# EAGLE schematic GC_LINE_2026_INCHEON (EAGLE 9.7.0)
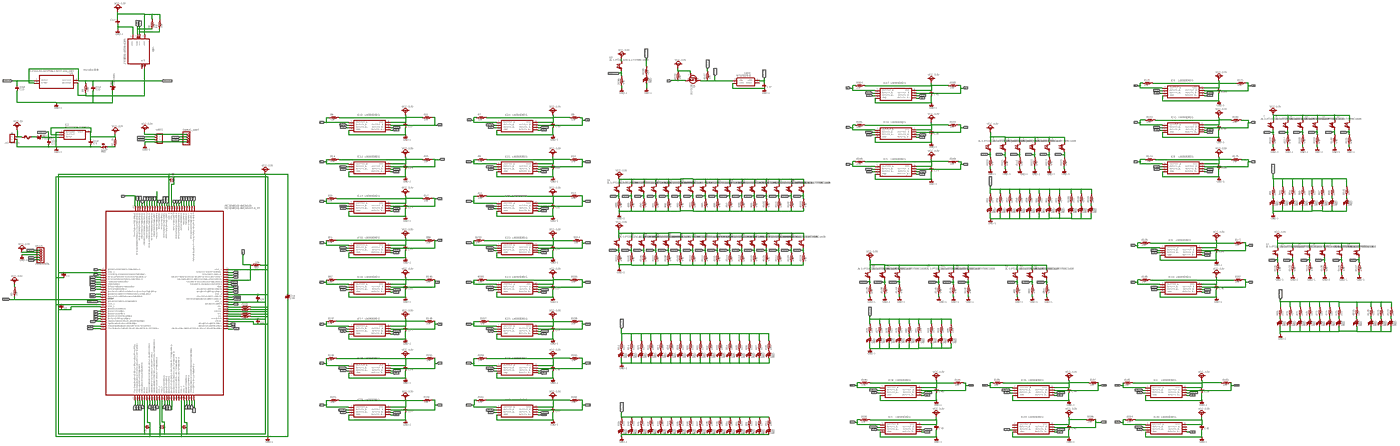
[diagram p0: schematic, sheet 1, overview]
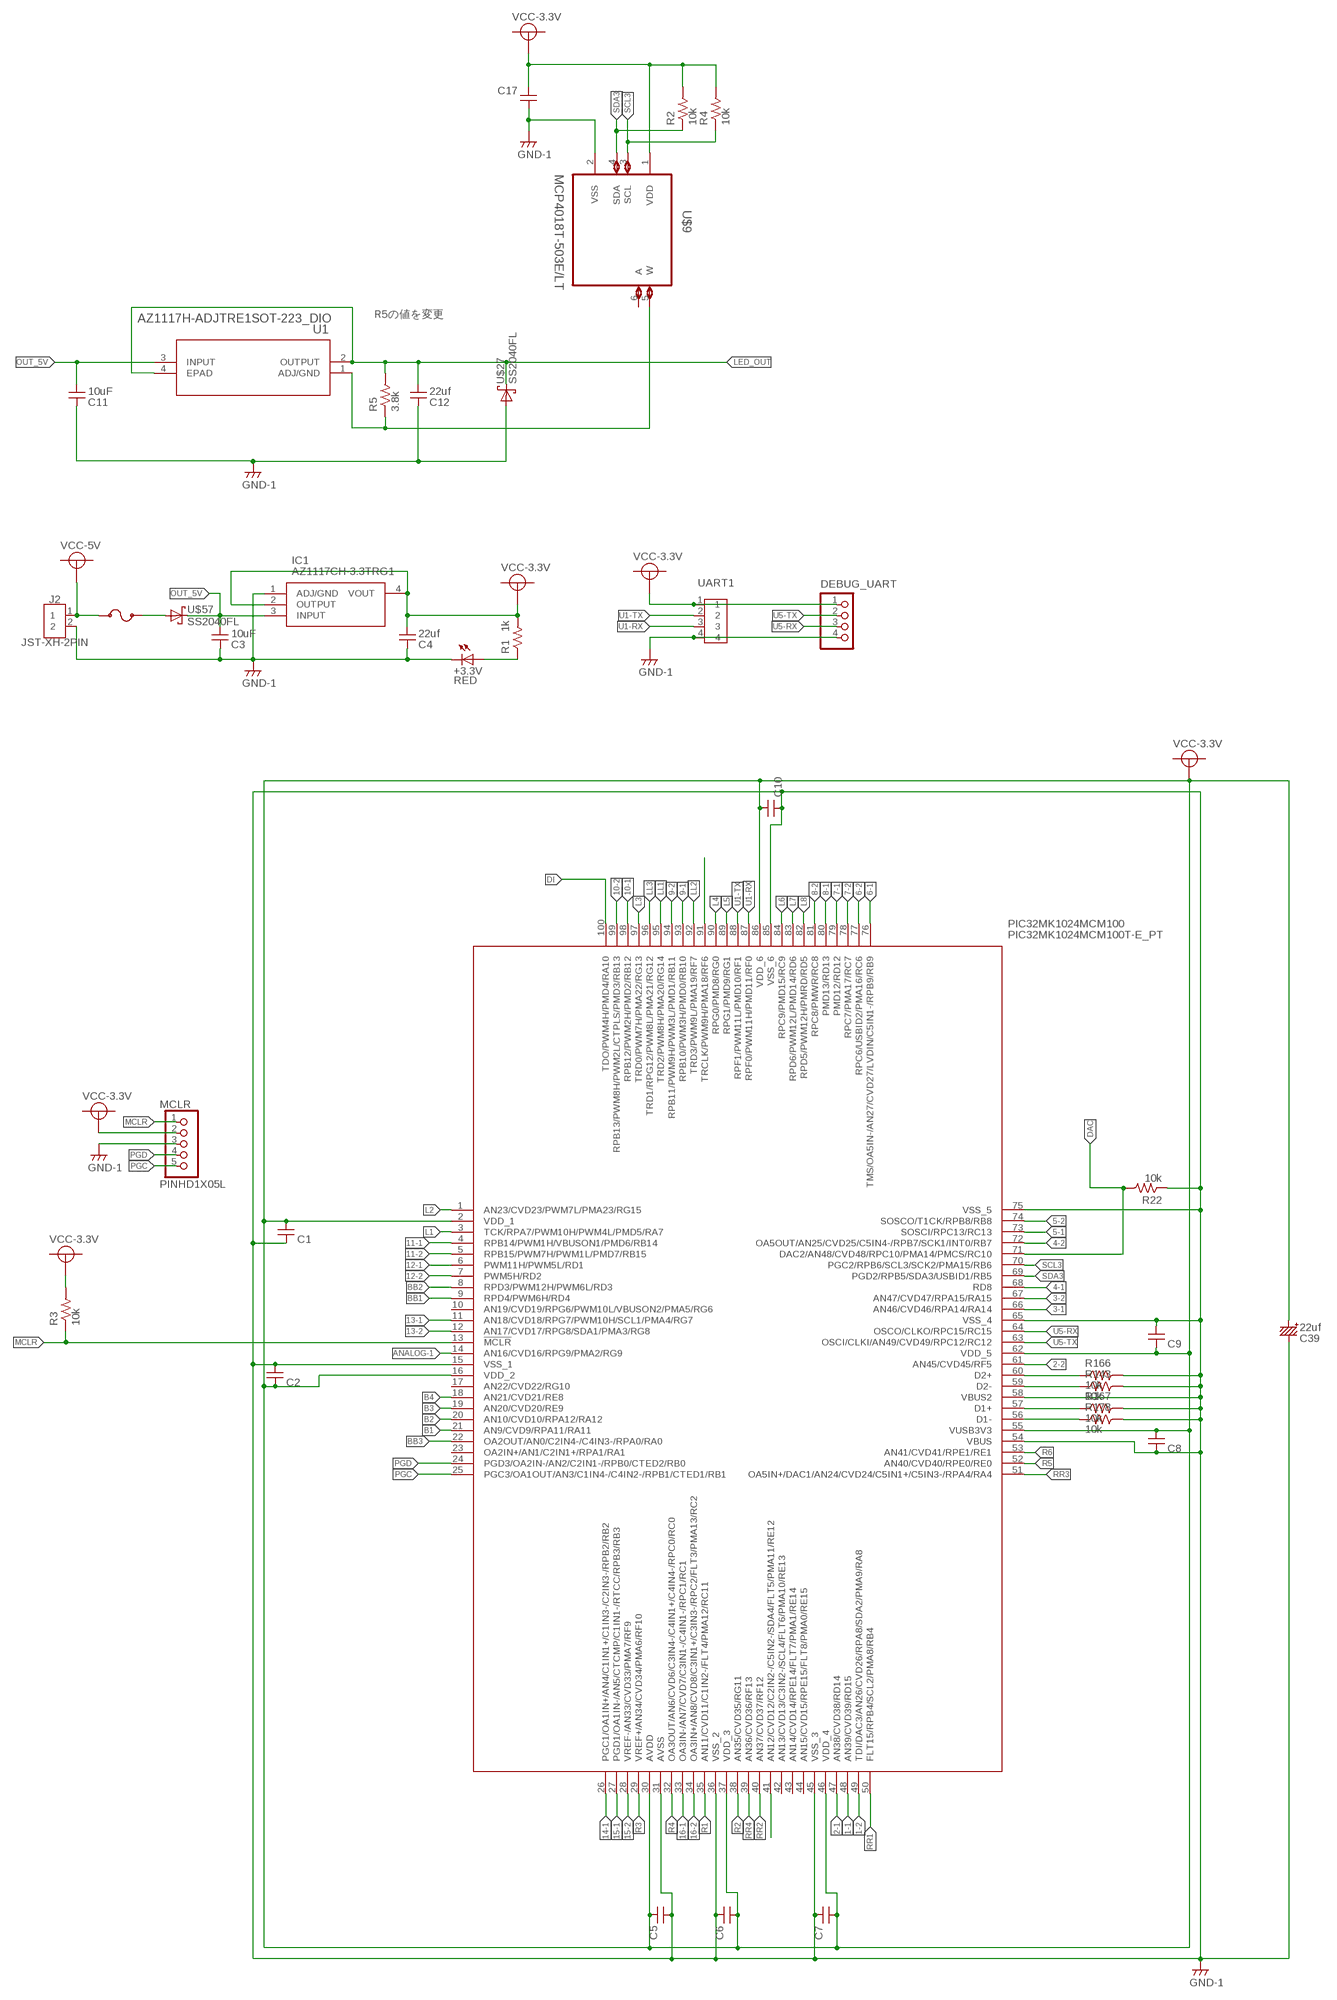
[diagram p1: schematic, sheet 1, part 1 of 4]
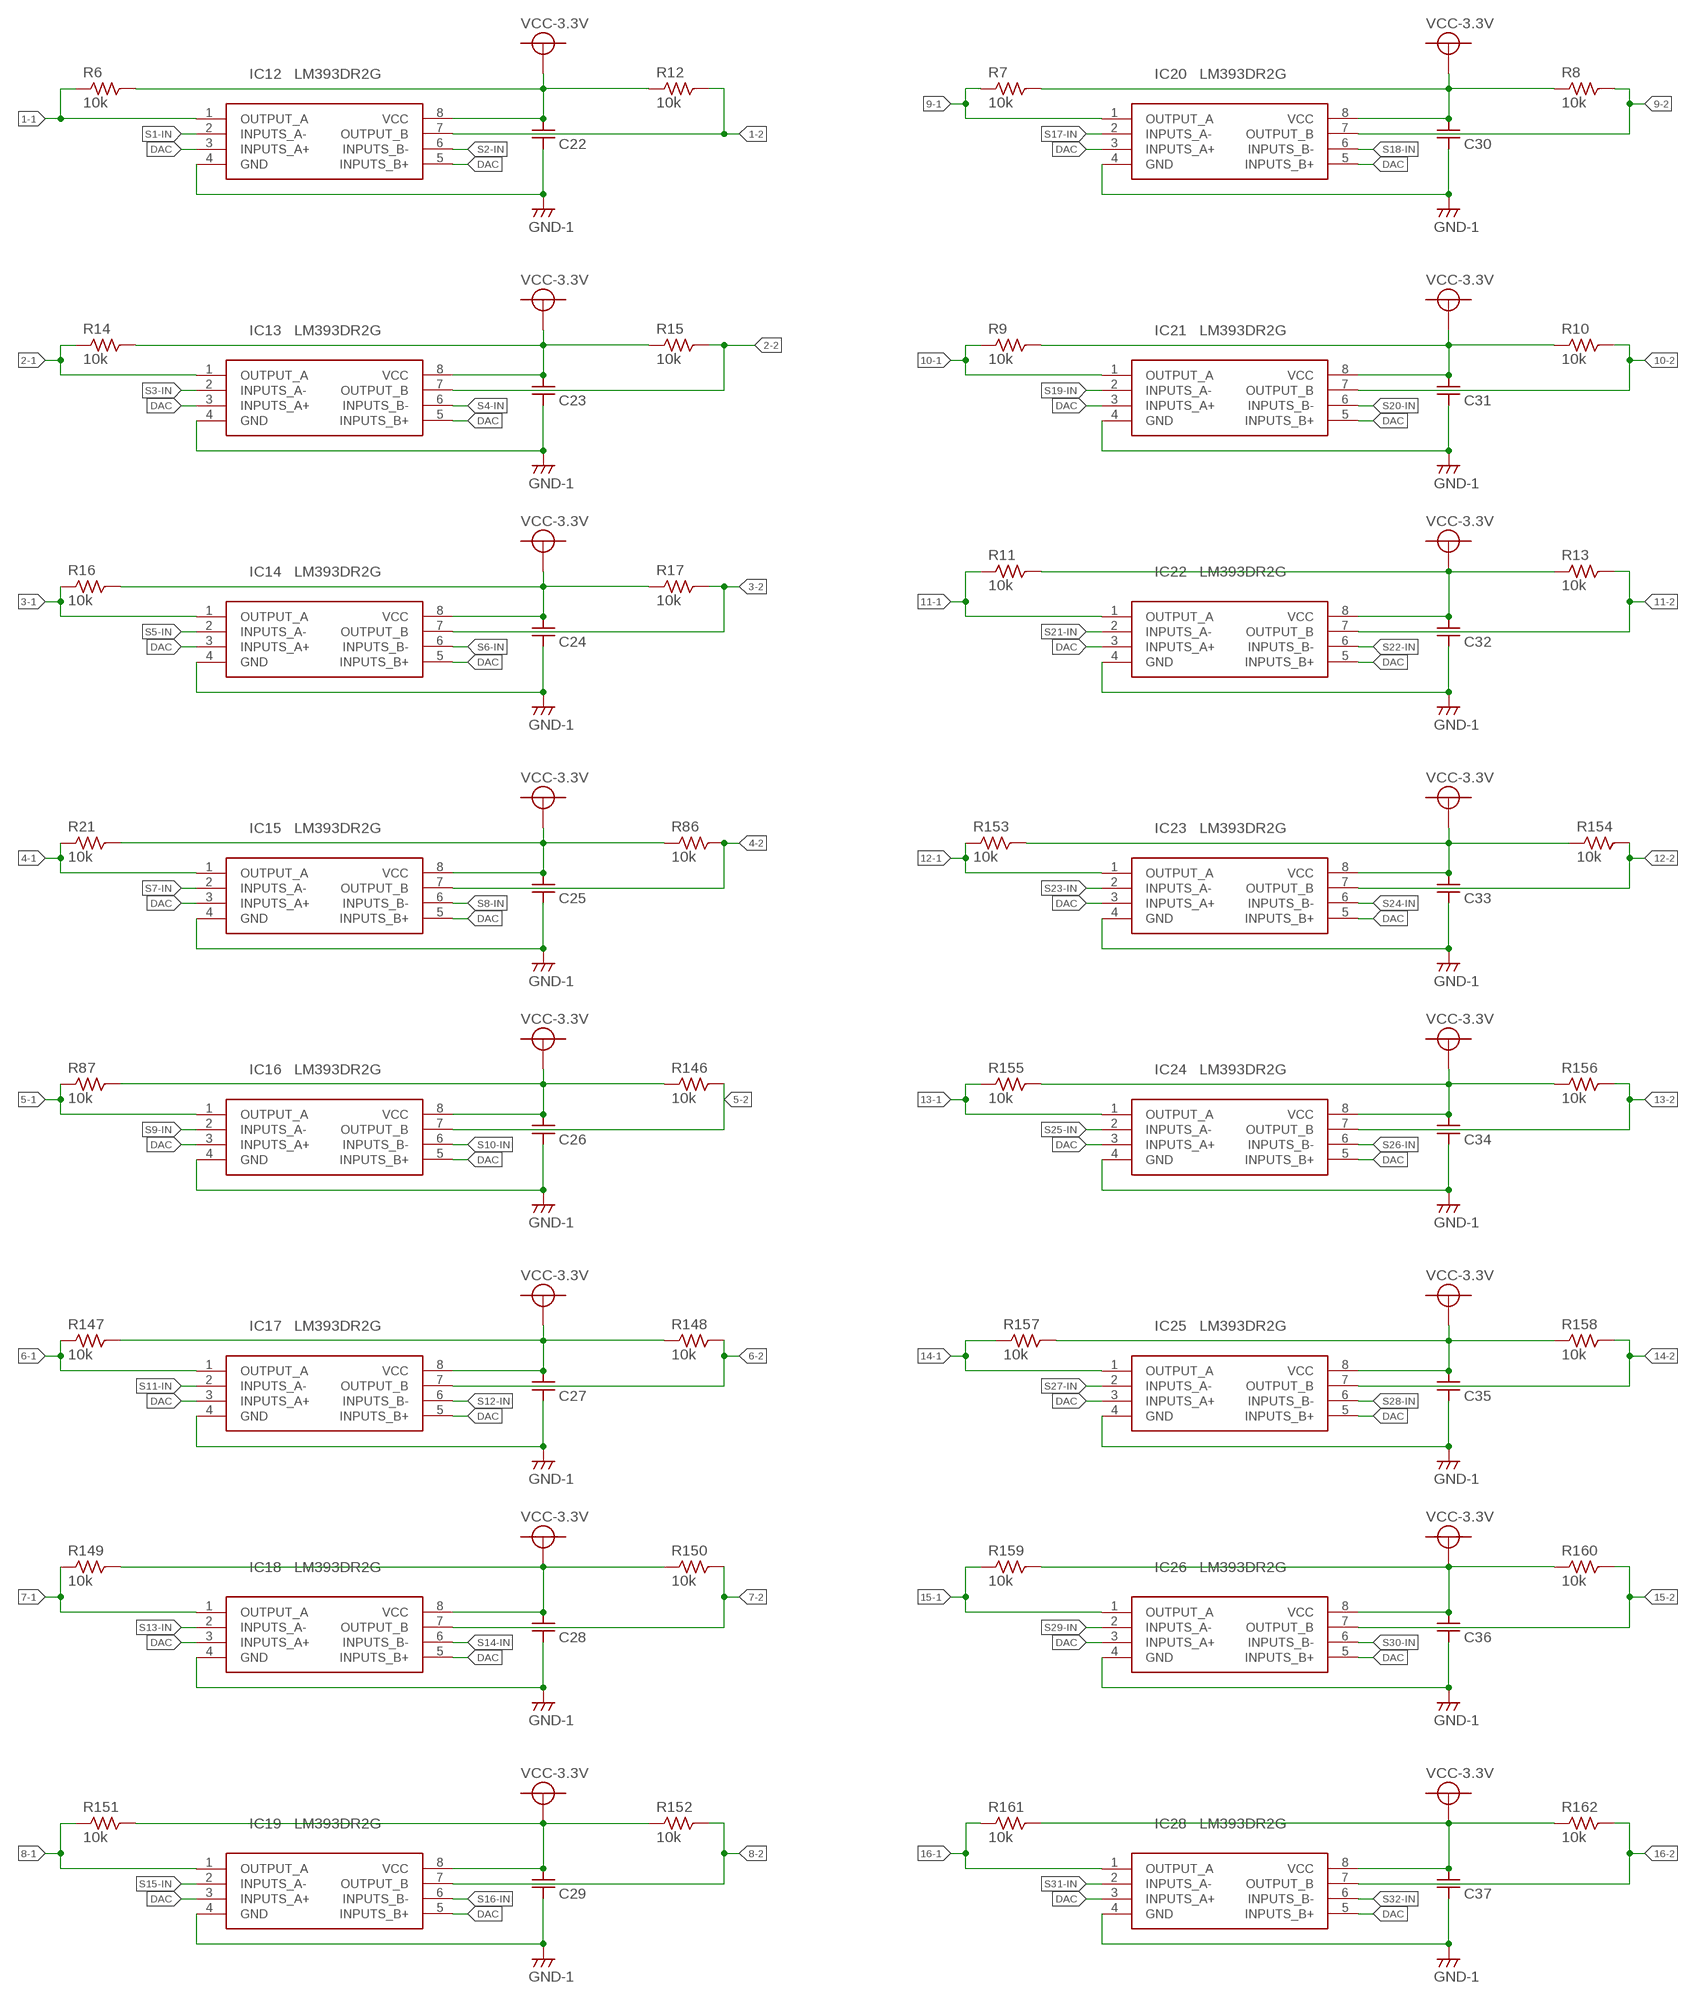
[diagram p2: schematic, sheet 1, part 2 of 4]
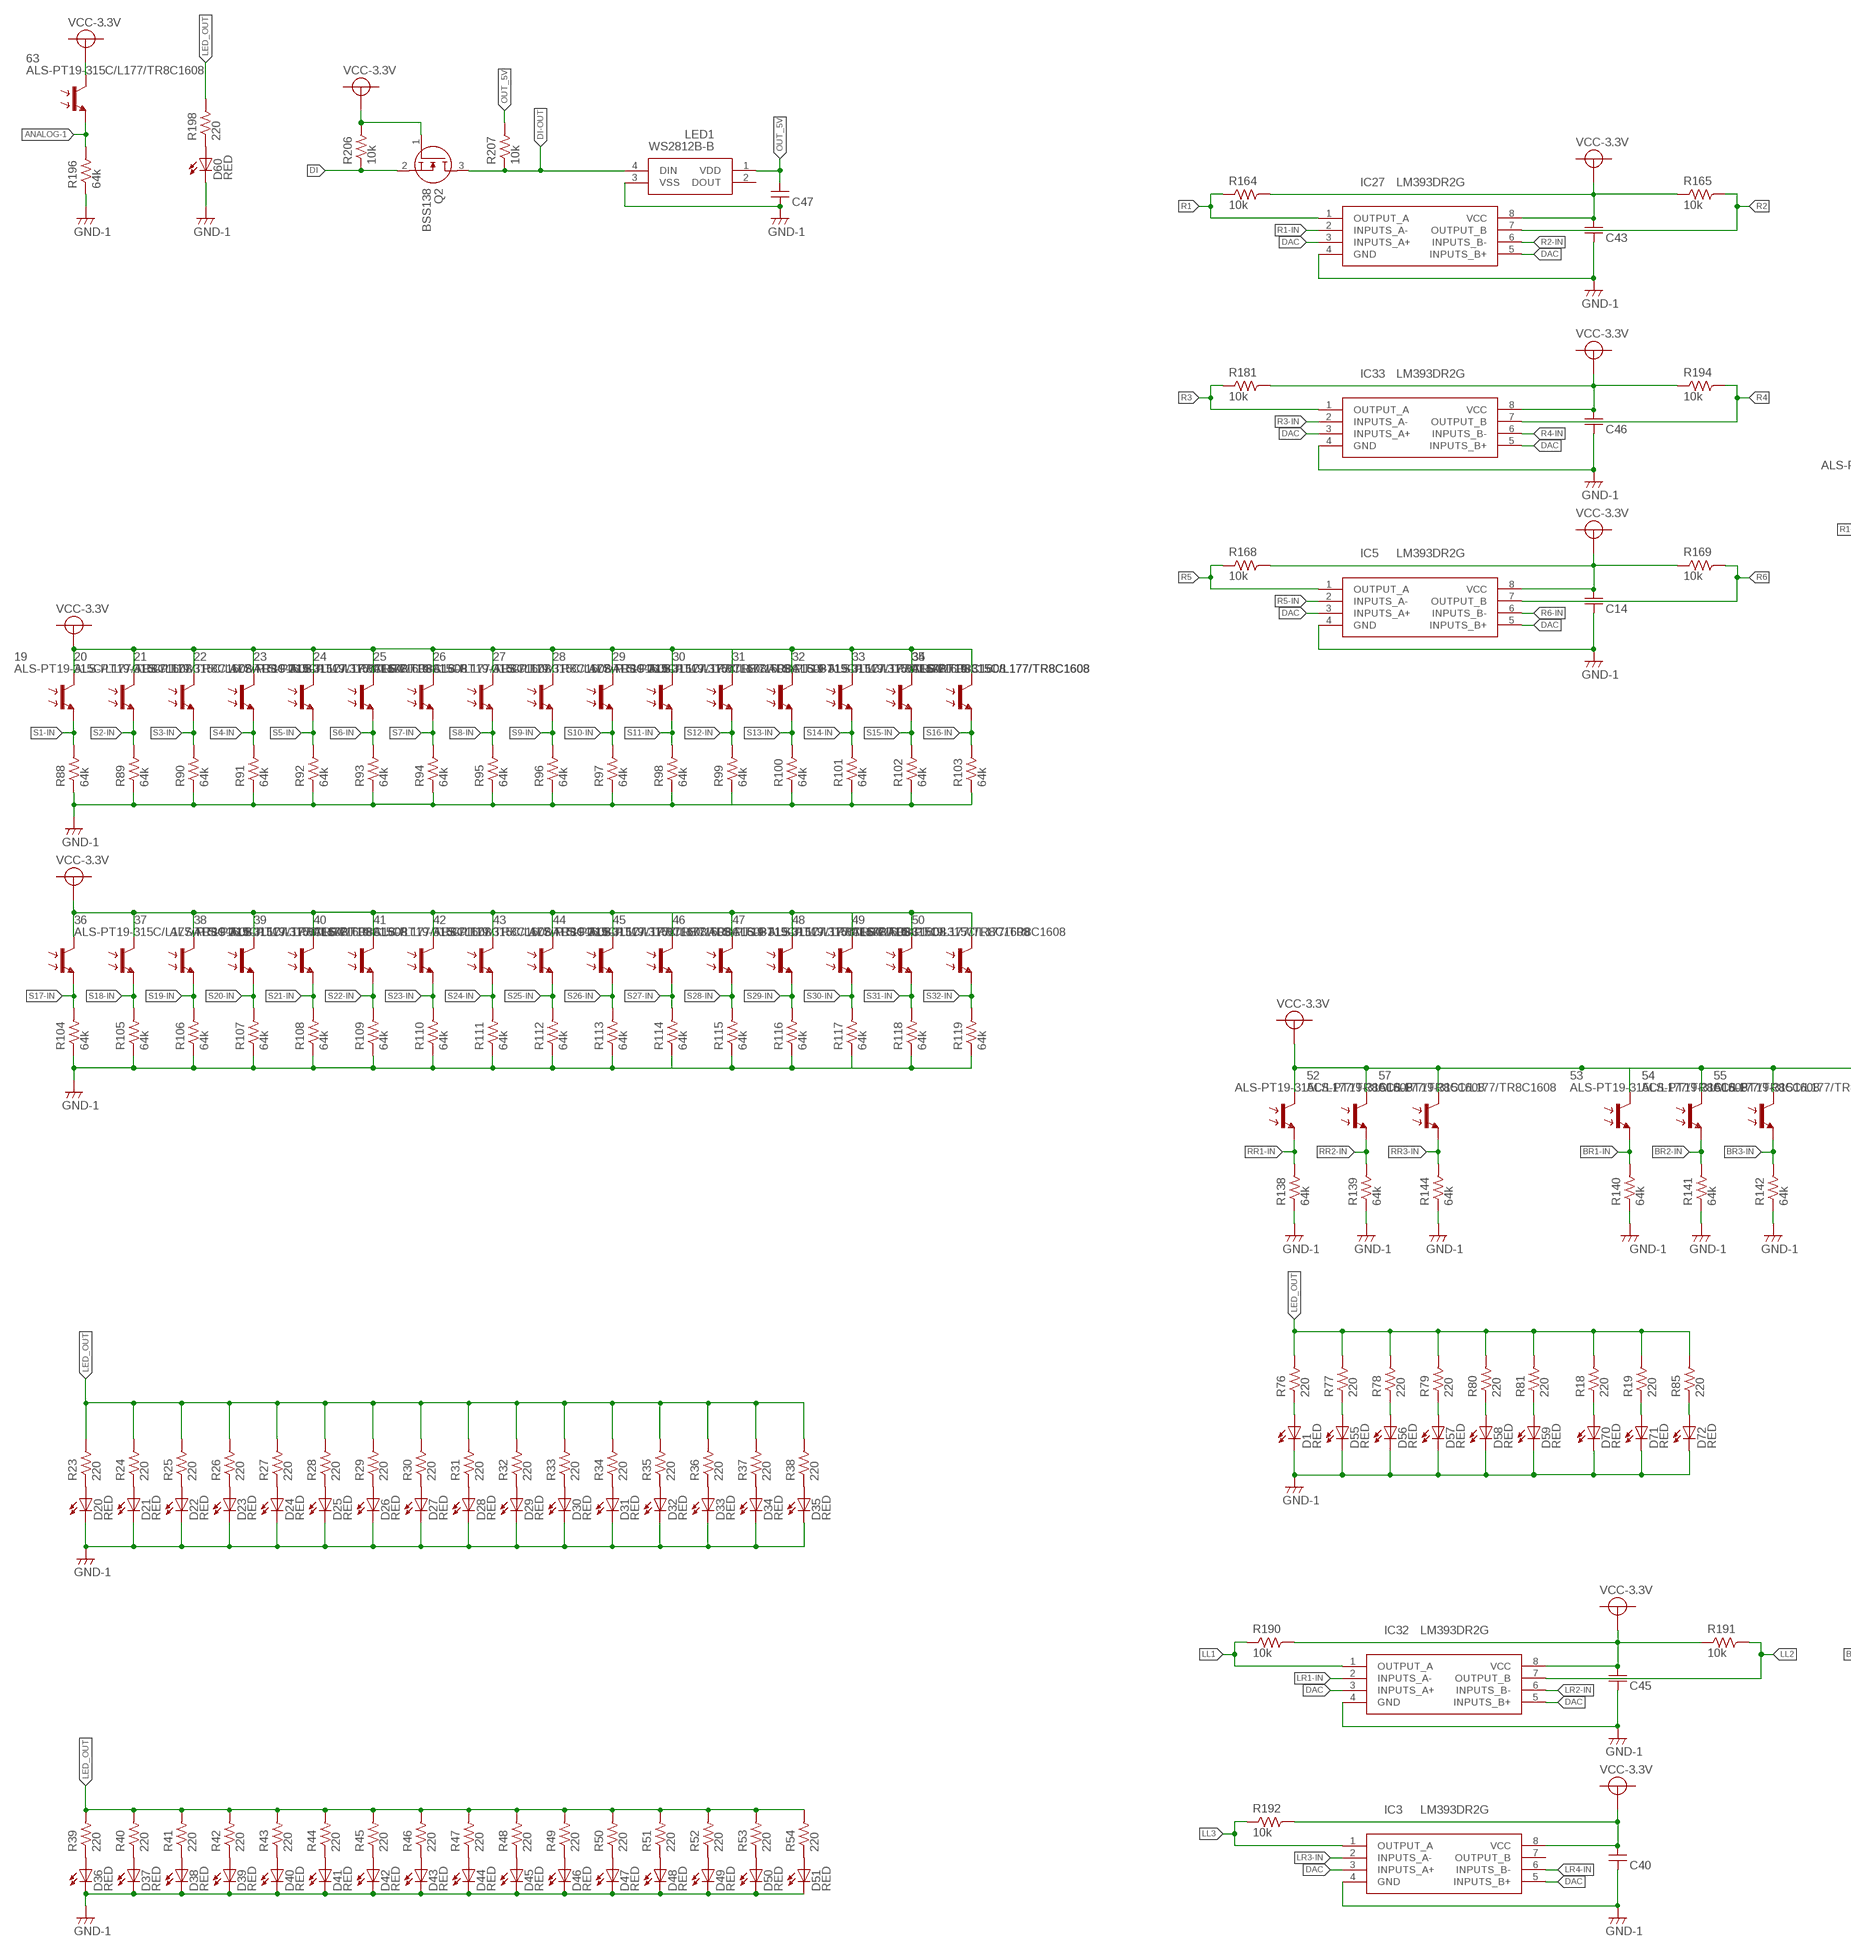
[diagram p3: schematic, sheet 1, part 3 of 4]
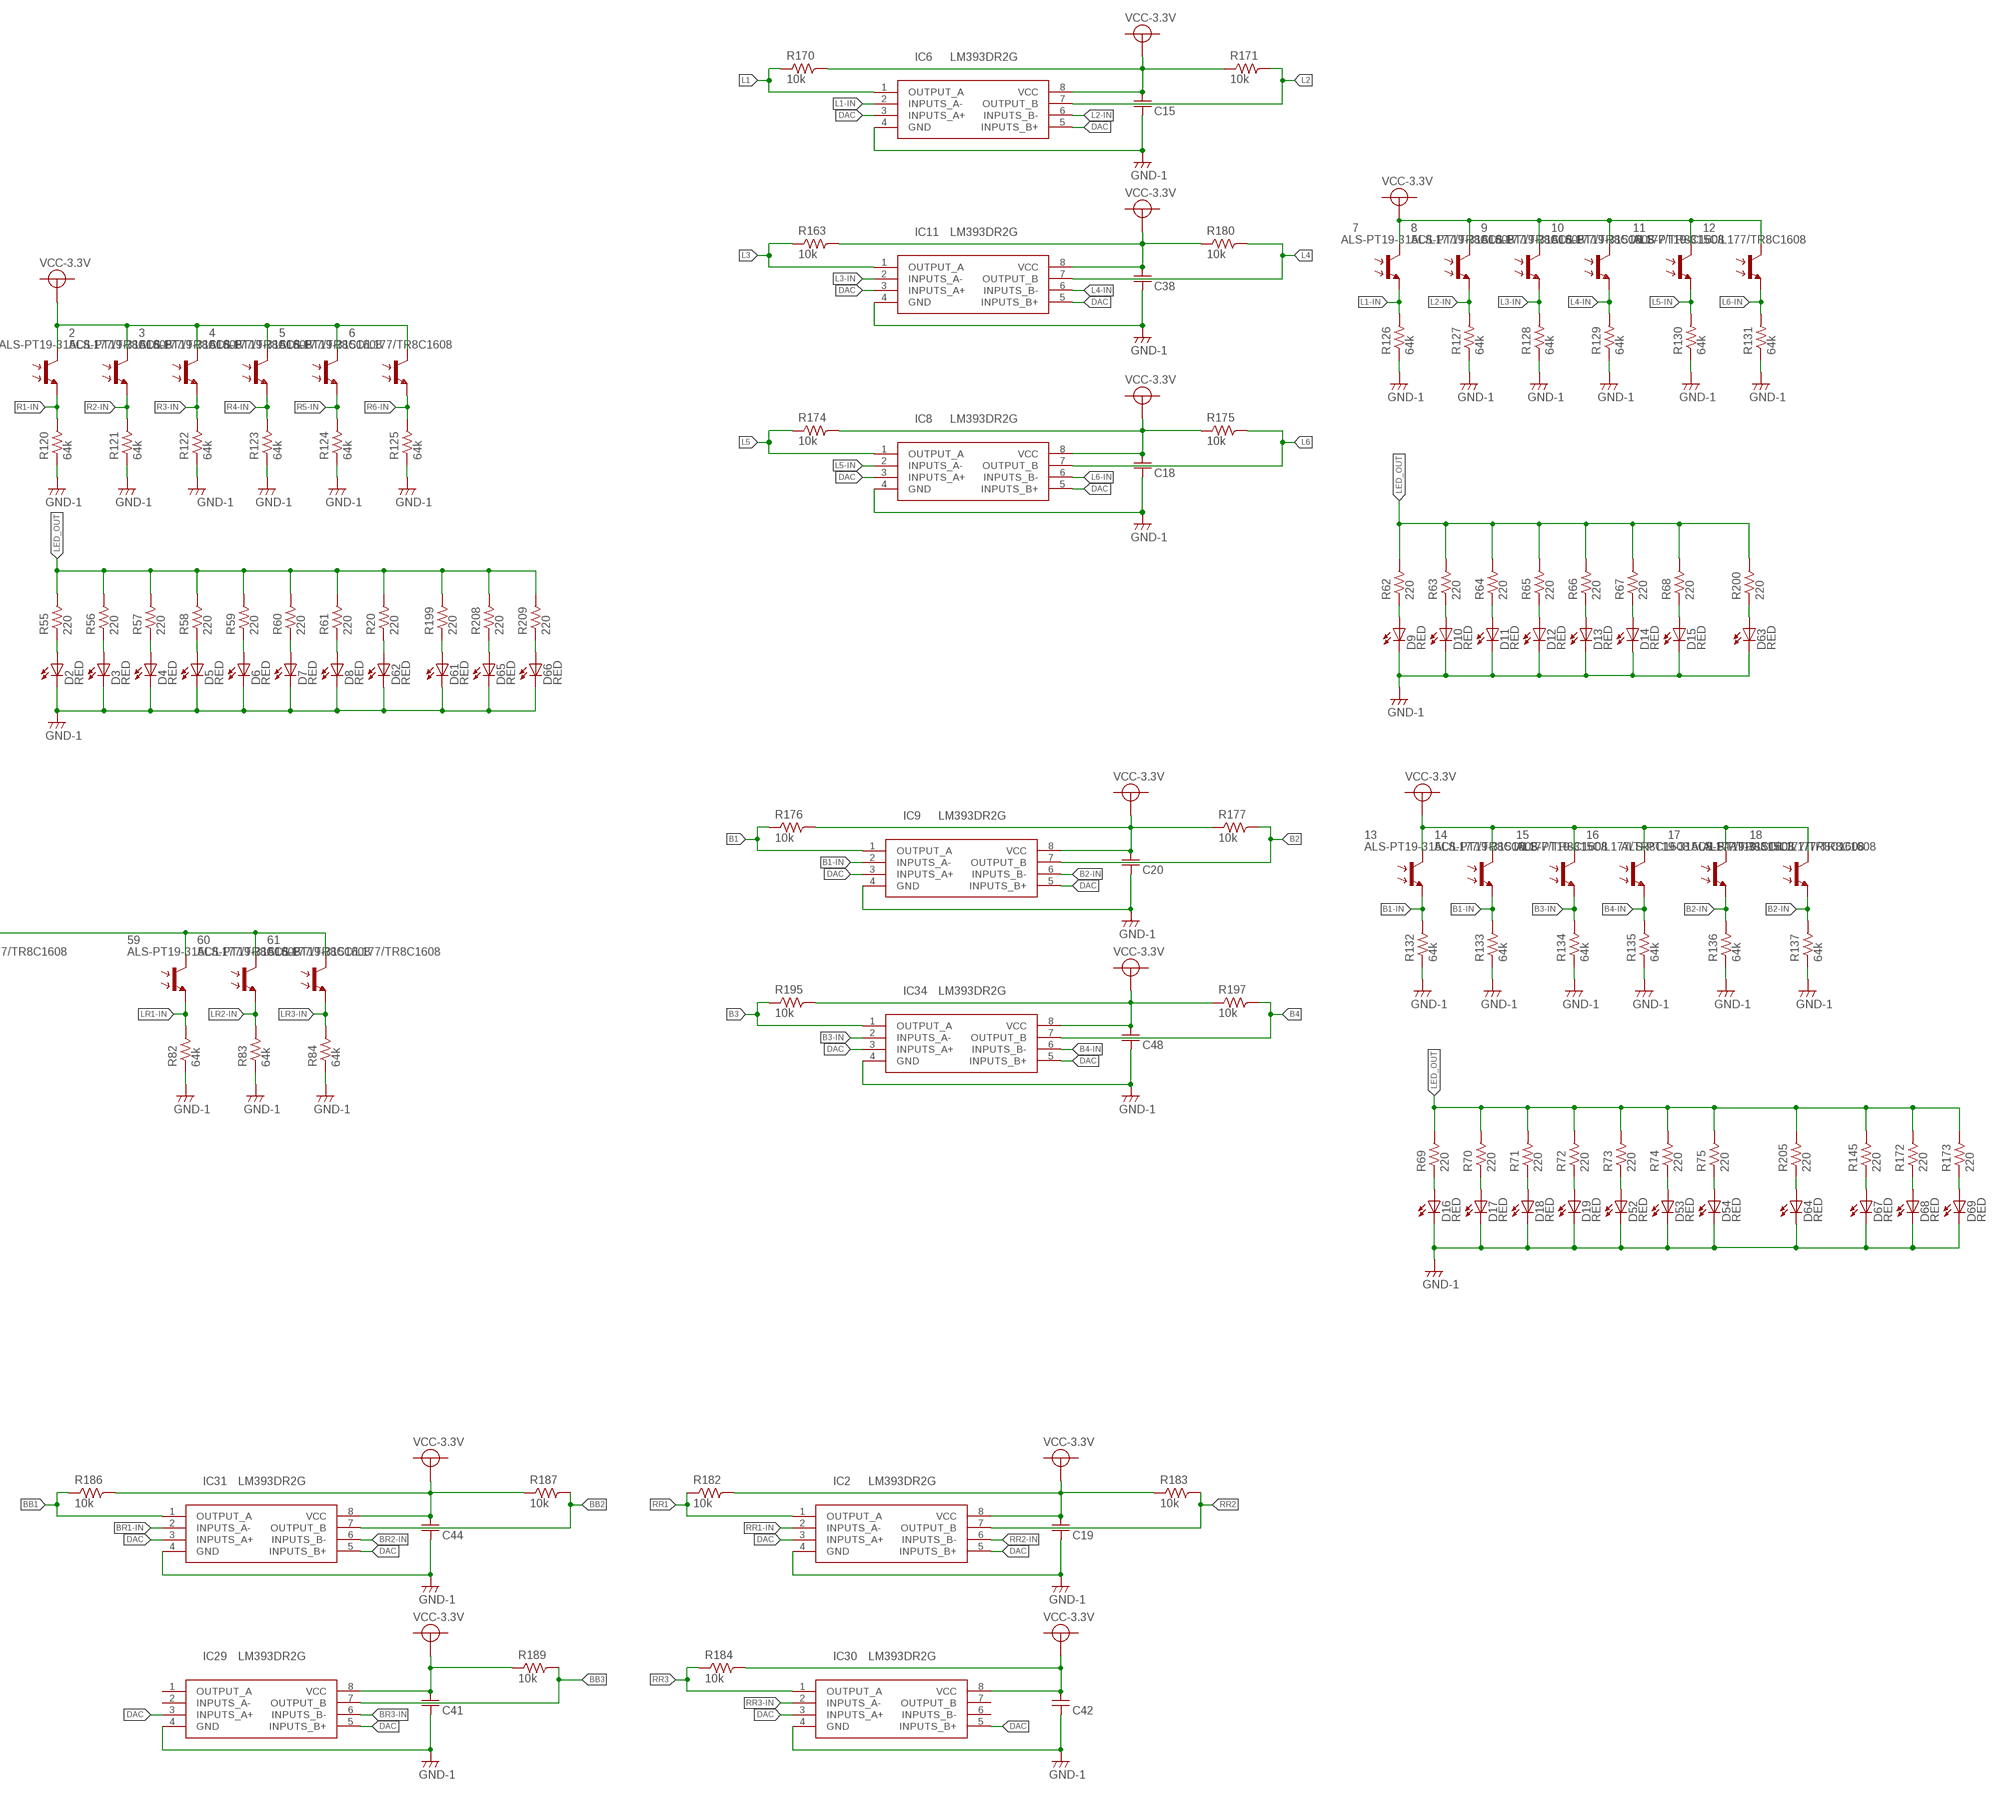
[diagram p4: schematic, sheet 1, part 4 of 4]

## Parts
1  ALS-PT19-315C/L177/TR8C1608  [C1608]
2  ALS-PT19-315C/L177/TR8C1608  [C1608]
3  ALS-PT19-315C/L177/TR8C1608  [C1608]
4  ALS-PT19-315C/L177/TR8C1608  [C1608]
5  ALS-PT19-315C/L177/TR8C1608  [C1608]
6  ALS-PT19-315C/L177/TR8C1608  [C1608]
7  ALS-PT19-315C/L177/TR8C1608  [C1608]
8  ALS-PT19-315C/L177/TR8C1608  [C1608]
9  ALS-PT19-315C/L177/TR8C1608  [C1608]
10  ALS-PT19-315C/L177/TR8C1608  [C1608]
11  ALS-PT19-315C/L177/TR8C1608  [C1608]
12  ALS-PT19-315C/L177/TR8C1608  [C1608]
13  ALS-PT19-315C/L177/TR8C1608  [C1608]
14  ALS-PT19-315C/L177/TR8C1608  [C1608]
15  ALS-PT19-315C/L177/TR8C1608  [C1608]
16  ALS-PT19-315C/L177/TR8C1608  [C1608]
17  ALS-PT19-315C/L177/TR8C1608  [C1608]
18  ALS-PT19-315C/L177/TR8C1608  [C1608]
19  ALS-PT19-315C/L177/TR8C1608  [C1608]
20  ALS-PT19-315C/L177/TR8C1608  [C1608]
21  ALS-PT19-315C/L177/TR8C1608  [C1608]
22  ALS-PT19-315C/L177/TR8C1608  [C1608]
23  ALS-PT19-315C/L177/TR8C1608  [C1608]
24  ALS-PT19-315C/L177/TR8C1608  [C1608]
25  ALS-PT19-315C/L177/TR8C1608  [C1608]
26  ALS-PT19-315C/L177/TR8C1608  [C1608]
27  ALS-PT19-315C/L177/TR8C1608  [C1608]
28  ALS-PT19-315C/L177/TR8C1608  [C1608]
29  ALS-PT19-315C/L177/TR8C1608  [C1608]
30  ALS-PT19-315C/L177/TR8C1608  [C1608]
31  ALS-PT19-315C/L177/TR8C1608  [C1608]
32  ALS-PT19-315C/L177/TR8C1608  [C1608]
33  ALS-PT19-315C/L177/TR8C1608  [C1608]
34  ALS-PT19-315C/L177/TR8C1608  [C1608]
35  ALS-PT19-315C/L177/TR8C1608  [C1608]
36  ALS-PT19-315C/L177/TR8C1608  [C1608]
37  ALS-PT19-315C/L177/TR8C1608  [C1608]
38  ALS-PT19-315C/L177/TR8C1608  [C1608]
39  ALS-PT19-315C/L177/TR8C1608  [C1608]
40  ALS-PT19-315C/L177/TR8C1608  [C1608]
41  ALS-PT19-315C/L177/TR8C1608  [C1608]
42  ALS-PT19-315C/L177/TR8C1608  [C1608]
43  ALS-PT19-315C/L177/TR8C1608  [C1608]
44  ALS-PT19-315C/L177/TR8C1608  [C1608]
45  ALS-PT19-315C/L177/TR8C1608  [C1608]
46  ALS-PT19-315C/L177/TR8C1608  [C1608]
47  ALS-PT19-315C/L177/TR8C1608  [C1608]
48  ALS-PT19-315C/L177/TR8C1608  [C1608]
49  ALS-PT19-315C/L177/TR8C1608  [C1608]
50  ALS-PT19-315C/L177/TR8C1608  [C1608]
51  ALS-PT19-315C/L177/TR8C1608  [C1608]
52  ALS-PT19-315C/L177/TR8C1608  [C1608]
53  ALS-PT19-315C/L177/TR8C1608  [C1608]
54  ALS-PT19-315C/L177/TR8C1608  [C1608]
55  ALS-PT19-315C/L177/TR8C1608  [C1608]
57  ALS-PT19-315C/L177/TR8C1608  [C1608]
59  ALS-PT19-315C/L177/TR8C1608  [C1608]
60  ALS-PT19-315C/L177/TR8C1608  [C1608]
61  ALS-PT19-315C/L177/TR8C1608  [C1608]
63  ALS-PT19-315C/L177/TR8C1608  [C1608]
+3.3V  RED  LEDRED  [LEDC1608X55N_FLAT-R]
C1  0.1uF  CC1068  [C1608]
C2  0.1uF  CC1068  [C1608]
C3  10uF  CC25V10UF1608(0603)  [C1608]
C4  22uf  CC6.3V22UF1608(0603)  [C1608]
C5  0.1uF  CC1068  [C1608]
C6  0.1uF  CC1068  [C1608]
C7  0.1uF  CC1068  [C1608]
C8  0.1uF  CC1068  [C1608]
C9  0.1uF  CC1068  [C1608]
C10  0.1uF  CC1068  [C1608]
C11  10uF  CC25V10UF1608(0603)  [C1608]
C12  22uf  CC6.3V22UF1608(0603)  [C1608]
C14  0.1uF  CC1068  [C1608]
C15  0.1uF  CC1068  [C1608]
C17  0.1uF  CC1068  [C1608]
C18  0.1uF  CC1068  [C1608]
C19  0.1uF  CC1068  [C1608]
C20  0.1uF  CC1068  [C1608]
C22  0.1uF  CC1068  [C1608]
C23  0.1uF  CC1068  [C1608]
C24  0.1uF  CC1068  [C1608]
C25  0.1uF  CC1068  [C1608]
C26  0.1uF  CC1068  [C1608]
C27  0.1uF  CC1068  [C1608]
C28  0.1uF  CC1068  [C1608]
C29  0.1uF  CC1068  [C1608]
C30  0.1uF  CC1068  [C1608]
C31  0.1uF  CC1068  [C1608]
C32  0.1uF  CC1068  [C1608]
C33  0.1uF  CC1068  [C1608]
C34  0.1uF  CC1068  [C1608]
C35  0.1uF  CC1068  [C1608]
C36  0.1uF  CC1068  [C1608]
C37  0.1uF  CC1068  [C1608]
C38  0.1uF  CC1068  [C1608]
C39  22uf  C+25V100  [CC:3]
C40  0.1uF  CC1068  [C1608]
C41  0.1uF  CC1068  [C1608]
C42  0.1uF  CC1068  [C1608]
C43  0.1uF  CC1068  [C1608]
C44  0.1uF  CC1068  [C1608]
C45  0.1uF  CC1068  [C1608]
C46  0.1uF  CC1068  [C1608]
C47  0.1uF  CC1068  [C1608]
C48  0.1uF  CC1068  [C1608]
D1  RED  LEDRED  [CHIPLED_0603]
D2  RED  LEDRED  [CHIPLED_0603]
D3  RED  LEDRED  [CHIPLED_0603]
D4  RED  LEDRED  [CHIPLED_0603]
D5  RED  LEDRED  [CHIPLED_0603]
D6  RED  LEDRED  [CHIPLED_0603]
D7  RED  LEDRED  [CHIPLED_0603]
D8  RED  LEDRED  [CHIPLED_0603]
D9  RED  LEDRED  [CHIPLED_0603]
D10  RED  LEDRED  [CHIPLED_0603]
D11  RED  LEDRED  [CHIPLED_0603]
D12  RED  LEDRED  [CHIPLED_0603]
D13  RED  LEDRED  [CHIPLED_0603]
D14  RED  LEDRED  [CHIPLED_0603]
D15  RED  LEDRED  [CHIPLED_0603]
D16  RED  LEDRED  [CHIPLED_0603]
D17  RED  LEDRED  [CHIPLED_0603]
D18  RED  LEDRED  [CHIPLED_0603]
D19  RED  LEDRED  [CHIPLED_0603]
D20  RED  LEDRED  [CHIPLED_0603]
D21  RED  LEDRED  [CHIPLED_0603]
D22  RED  LEDRED  [CHIPLED_0603]
D23  RED  LEDRED  [CHIPLED_0603]
D24  RED  LEDRED  [CHIPLED_0603]
D25  RED  LEDRED  [CHIPLED_0603]
D26  RED  LEDRED  [CHIPLED_0603]
D27  RED  LEDRED  [CHIPLED_0603]
D28  RED  LEDRED  [CHIPLED_0603]
D29  RED  LEDRED  [CHIPLED_0603]
D30  RED  LEDRED  [CHIPLED_0603]
D31  RED  LEDRED  [CHIPLED_0603]
D32  RED  LEDRED  [CHIPLED_0603]
D33  RED  LEDRED  [CHIPLED_0603]
D34  RED  LEDRED  [CHIPLED_0603]
D35  RED  LEDRED  [CHIPLED_0603]
D36  RED  LEDRED  [CHIPLED_0603]
D37  RED  LEDRED  [CHIPLED_0603]
D38  RED  LEDRED  [CHIPLED_0603]
D39  RED  LEDRED  [CHIPLED_0603]
D40  RED  LEDRED  [CHIPLED_0603]
D41  RED  LEDRED  [CHIPLED_0603]
D42  RED  LEDRED  [CHIPLED_0603]
D43  RED  LEDRED  [CHIPLED_0603]
D44  RED  LEDRED  [CHIPLED_0603]
D45  RED  LEDRED  [CHIPLED_0603]
D46  RED  LEDRED  [CHIPLED_0603]
D47  RED  LEDRED  [CHIPLED_0603]
D48  RED  LEDRED  [CHIPLED_0603]
D49  RED  LEDRED  [CHIPLED_0603]
D50  RED  LEDRED  [CHIPLED_0603]
D51  RED  LEDRED  [CHIPLED_0603]
D52  RED  LEDRED  [CHIPLED_0603]
D53  RED  LEDRED  [CHIPLED_0603]
D54  RED  LEDRED  [CHIPLED_0603]
D55  RED  LEDRED  [CHIPLED_0603]
D56  RED  LEDRED  [CHIPLED_0603]
D57  RED  LEDRED  [CHIPLED_0603]
D58  RED  LEDRED  [CHIPLED_0603]
D59  RED  LEDRED  [CHIPLED_0603]
D60  RED  LEDRED  [CHIPLED_0603]
D61  RED  LEDRED  [CHIPLED_0603]
D62  RED  LEDRED  [CHIPLED_0603]
D63  RED  LEDRED  [CHIPLED_0603]
D64  RED  LEDRED  [CHIPLED_0603]
D65  RED  LEDRED  [CHIPLED_0603]
D66  RED  LEDRED  [CHIPLED_0603]
D67  RED  LEDRED  [CHIPLED_0603]
D68  RED  LEDRED  [CHIPLED_0603]
D69  RED  LEDRED  [CHIPLED_0603]
D70  RED  LEDRED  [CHIPLED_0603]
D71  RED  LEDRED  [CHIPLED_0603]
D72  RED  LEDRED  [CHIPLED_0603]
DEBUG_UART  S4B-XH-A  [S4B-XH-A]
IC1  AZ1117CH-3.3TRG1  [SOT230P700X180-4N]
IC2  LM393DR2G  [SOIC127P600X175-8N]
IC3  LM393DR2G  [SOIC127P600X175-8N]
IC5  LM393DR2G  [SOIC127P600X175-8N]
IC6  LM393DR2G  [SOIC127P600X175-8N]
IC8  LM393DR2G  [SOIC127P600X175-8N]
IC9  LM393DR2G  [SOIC127P600X175-8N]
IC11  LM393DR2G  [SOIC127P600X175-8N]
IC12  LM393DR2G  [SOIC127P600X175-8N]
IC13  LM393DR2G  [SOIC127P600X175-8N]
IC14  LM393DR2G  [SOIC127P600X175-8N]
IC15  LM393DR2G  [SOIC127P600X175-8N]
IC16  LM393DR2G  [SOIC127P600X175-8N]
IC17  LM393DR2G  [SOIC127P600X175-8N]
IC18  LM393DR2G  [SOIC127P600X175-8N]
IC19  LM393DR2G  [SOIC127P600X175-8N]
IC20  LM393DR2G  [SOIC127P600X175-8N]
IC21  LM393DR2G  [SOIC127P600X175-8N]
IC22  LM393DR2G  [SOIC127P600X175-8N]
IC23  LM393DR2G  [SOIC127P600X175-8N]
IC24  LM393DR2G  [SOIC127P600X175-8N]
IC25  LM393DR2G  [SOIC127P600X175-8N]
IC26  LM393DR2G  [SOIC127P600X175-8N]
IC27  LM393DR2G  [SOIC127P600X175-8N]
IC28  LM393DR2G  [SOIC127P600X175-8N]
IC29  LM393DR2G  [SOIC127P600X175-8N]
IC30  LM393DR2G  [SOIC127P600X175-8N]
IC31  LM393DR2G  [SOIC127P600X175-8N]
IC32  LM393DR2G  [SOIC127P600X175-8N]
IC33  LM393DR2G  [SOIC127P600X175-8N]
IC34  LM393DR2G  [SOIC127P600X175-8N]
J2  JST-XH-2PIN  B2B-XH-A  [B2B-XH-A]
LED1  WS2812B-B  [WS2812BB]
MCLR  PINHD1X05L  [1X05L]
PIC32MK1024MCM100  PIC32MK1024MCM100T-E_PT  [QFP40P1400X1400X120-100N]
Q2  BSS138  [SOT95P240X120-3N]
R1  1k  R1K/1608(0603)  [R1608]
R2  10k  R10K/1608(0603)  [R1608]
R3  10k  R10K/1608(0603)  [R1608]
R4  10k  R10K/1608(0603)  [R1608]
R5  3.8k  R1K/1608(0603)  [R1608]
R6  10k  R10K/1608(0603)  [R1608]
R7  10k  R10K/1608(0603)  [R1608]
R8  10k  R10K/1608(0603)  [R1608]
R9  10k  R10K/1608(0603)  [R1608]
R10  10k  R10K/1608(0603)  [R1608]
R11  10k  R10K/1608(0603)  [R1608]
R12  10k  R10K/1608(0603)  [R1608]
R13  10k  R10K/1608(0603)  [R1608]
R14  10k  R10K/1608(0603)  [R1608]
R15  10k  R10K/1608(0603)  [R1608]
R16  10k  R10K/1608(0603)  [R1608]
R17  10k  R10K/1608(0603)  [R1608]
R18  220  R220/1608(0603)  [R1608]
R19  220  R220/1608(0603)  [R1608]
R20  220  R220/1608(0603)  [R1608]
R21  10k  R10K/1608(0603)  [R1608]
R22  10k  R10K/1608(0603)  [R1608]
R23  220  R220/1608(0603)  [R1608]
R24  220  R220/1608(0603)  [R1608]
R25  220  R220/1608(0603)  [R1608]
R26  220  R220/1608(0603)  [R1608]
R27  220  R220/1608(0603)  [R1608]
R28  220  R220/1608(0603)  [R1608]
R29  220  R220/1608(0603)  [R1608]
R30  220  R220/1608(0603)  [R1608]
R31  220  R220/1608(0603)  [R1608]
R32  220  R220/1608(0603)  [R1608]
R33  220  R220/1608(0603)  [R1608]
R34  220  R220/1608(0603)  [R1608]
R35  220  R220/1608(0603)  [R1608]
R36  220  R220/1608(0603)  [R1608]
R37  220  R220/1608(0603)  [R1608]
R38  220  R220/1608(0603)  [R1608]
R39  220  R220/1608(0603)  [R1608]
R40  220  R220/1608(0603)  [R1608]
R41  220  R220/1608(0603)  [R1608]
R42  220  R220/1608(0603)  [R1608]
R43  220  R220/1608(0603)  [R1608]
R44  220  R220/1608(0603)  [R1608]
R45  220  R220/1608(0603)  [R1608]
R46  220  R220/1608(0603)  [R1608]
R47  220  R220/1608(0603)  [R1608]
R48  220  R220/1608(0603)  [R1608]
R49  220  R220/1608(0603)  [R1608]
R50  220  R220/1608(0603)  [R1608]
R51  220  R220/1608(0603)  [R1608]
R52  220  R220/1608(0603)  [R1608]
R53  220  R220/1608(0603)  [R1608]
R54  220  R220/1608(0603)  [R1608]
R55  220  R220/1608(0603)  [R1608]
R56  220  R220/1608(0603)  [R1608]
R57  220  R220/1608(0603)  [R1608]
R58  220  R220/1608(0603)  [R1608]
R59  220  R220/1608(0603)  [R1608]
R60  220  R220/1608(0603)  [R1608]
R61  220  R220/1608(0603)  [R1608]
R62  220  R220/1608(0603)  [R1608]
R63  220  R220/1608(0603)  [R1608]
R64  220  R220/1608(0603)  [R1608]
R65  220  R220/1608(0603)  [R1608]
R66  220  R220/1608(0603)  [R1608]
R67  220  R220/1608(0603)  [R1608]
R68  220  R220/1608(0603)  [R1608]
R69  220  R220/1608(0603)  [R1608]
R70  220  R220/1608(0603)  [R1608]
R71  220  R220/1608(0603)  [R1608]
R72  220  R220/1608(0603)  [R1608]
R73  220  R220/1608(0603)  [R1608]
R74  220  R220/1608(0603)  [R1608]
R75  220  R220/1608(0603)  [R1608]
R76  220  R220/1608(0603)  [R1608]
R77  220  R220/1608(0603)  [R1608]
R78  220  R220/1608(0603)  [R1608]
R79  220  R220/1608(0603)  [R1608]
R80  220  R220/1608(0603)  [R1608]
R81  220  R220/1608(0603)  [R1608]
R82  64k  R64K/1608(0603)  [R1608]
R83  64k  R64K/1608(0603)  [R1608]
R84  64k  R64K/1608(0603)  [R1608]
R85  220  R220/1608(0603)  [R1608]
R86  10k  R10K/1608(0603)  [R1608]
R87  10k  R10K/1608(0603)  [R1608]
R88  64k  R64K/1608(0603)  [R1608]
R89  64k  R64K/1608(0603)  [R1608]
R90  64k  R64K/1608(0603)  [R1608]
R91  64k  R64K/1608(0603)  [R1608]
R92  64k  R64K/1608(0603)  [R1608]
R93  64k  R64K/1608(0603)  [R1608]
R94  64k  R64K/1608(0603)  [R1608]
R95  64k  R64K/1608(0603)  [R1608]
R96  64k  R64K/1608(0603)  [R1608]
R97  64k  R64K/1608(0603)  [R1608]
R98  64k  R64K/1608(0603)  [R1608]
R99  64k  R64K/1608(0603)  [R1608]
R100  64k  R64K/1608(0603)  [R1608]
R101  64k  R64K/1608(0603)  [R1608]
R102  64k  R64K/1608(0603)  [R1608]
R103  64k  R64K/1608(0603)  [R1608]
R104  64k  R64K/1608(0603)  [R1608]
R105  64k  R64K/1608(0603)  [R1608]
R106  64k  R64K/1608(0603)  [R1608]
R107  64k  R64K/1608(0603)  [R1608]
R108  64k  R64K/1608(0603)  [R1608]
R109  64k  R64K/1608(0603)  [R1608]
R110  64k  R64K/1608(0603)  [R1608]
R111  64k  R64K/1608(0603)  [R1608]
R112  64k  R64K/1608(0603)  [R1608]
R113  64k  R64K/1608(0603)  [R1608]
R114  64k  R64K/1608(0603)  [R1608]
R115  64k  R64K/1608(0603)  [R1608]
R116  64k  R64K/1608(0603)  [R1608]
R117  64k  R64K/1608(0603)  [R1608]
R118  64k  R64K/1608(0603)  [R1608]
R119  64k  R64K/1608(0603)  [R1608]
R120  64k  R64K/1608(0603)  [R1608]
R121  64k  R64K/1608(0603)  [R1608]
R122  64k  R64K/1608(0603)  [R1608]
R123  64k  R64K/1608(0603)  [R1608]
R124  64k  R64K/1608(0603)  [R1608]
R125  64k  R64K/1608(0603)  [R1608]
R126  64k  R64K/1608(0603)  [R1608]
R127  64k  R64K/1608(0603)  [R1608]
R128  64k  R64K/1608(0603)  [R1608]
R129  64k  R64K/1608(0603)  [R1608]
R130  64k  R64K/1608(0603)  [R1608]
R131  64k  R64K/1608(0603)  [R1608]
R132  64k  R64K/1608(0603)  [R1608]
R133  64k  R64K/1608(0603)  [R1608]
R134  64k  R64K/1608(0603)  [R1608]
R135  64k  R64K/1608(0603)  [R1608]
R136  64k  R64K/1608(0603)  [R1608]
R137  64k  R64K/1608(0603)  [R1608]
R138  64k  R64K/1608(0603)  [R1608]
R139  64k  R64K/1608(0603)  [R1608]
R140  64k  R64K/1608(0603)  [R1608]
R141  64k  R64K/1608(0603)  [R1608]
R142  64k  R64K/1608(0603)  [R1608]
R143  10k  R10K/1608(0603)  [R1608]
R144  64k  R64K/1608(0603)  [R1608]
R145  220  R220/1608(0603)  [R1608]
R146  10k  R10K/1608(0603)  [R1608]
R147  10k  R10K/1608(0603)  [R1608]
R148  10k  R10K/1608(0603)  [R1608]
R149  10k  R10K/1608(0603)  [R1608]
R150  10k  R10K/1608(0603)  [R1608]
R151  10k  R10K/1608(0603)  [R1608]
R152  10k  R10K/1608(0603)  [R1608]
R153  10k  R10K/1608(0603)  [R1608]
R154  10k  R10K/1608(0603)  [R1608]
R155  10k  R10K/1608(0603)  [R1608]
R156  10k  R10K/1608(0603)  [R1608]
R157  10k  R10K/1608(0603)  [R1608]
R158  10k  R10K/1608(0603)  [R1608]
R159  10k  R10K/1608(0603)  [R1608]
R160  10k  R10K/1608(0603)  [R1608]
R161  10k  R10K/1608(0603)  [R1608]
R162  10k  R10K/1608(0603)  [R1608]
R163  10k  R10K/1608(0603)  [R1608]
R164  10k  R10K/1608(0603)  [R1608]
R165  10k  R10K/1608(0603)  [R1608]
R166  10k  R10K/1608(0603)  [R1608]
R167  10k  R10K/1608(0603)  [R1608]
R168  10k  R10K/1608(0603)  [R1608]
R169  10k  R10K/1608(0603)  [R1608]
R170  10k  R10K/1608(0603)  [R1608]
R171  10k  R10K/1608(0603)  [R1608]
R172  220  R220/1608(0603)  [R1608]
R173  220  R220/1608(0603)  [R1608]
R174  10k  R10K/1608(0603)  [R1608]
R175  10k  R10K/1608(0603)  [R1608]
R176  10k  R10K/1608(0603)  [R1608]
R177  10k  R10K/1608(0603)  [R1608]
R178  10k  R10K/1608(0603)  [R1608]
R180  10k  R10K/1608(0603)  [R1608]
R181  10k  R10K/1608(0603)  [R1608]
R182  10k  R10K/1608(0603)  [R1608]
R183  10k  R10K/1608(0603)  [R1608]
R184  10k  R10K/1608(0603)  [R1608]
R186  10k  R10K/1608(0603)  [R1608]
R187  10k  R10K/1608(0603)  [R1608]
R189  10k  R10K/1608(0603)  [R1608]
R190  10k  R10K/1608(0603)  [R1608]
R191  10k  R10K/1608(0603)  [R1608]
R192  10k  R10K/1608(0603)  [R1608]
R194  10k  R10K/1608(0603)  [R1608]
R195  10k  R10K/1608(0603)  [R1608]
R196  64k  R64K/1608(0603)  [R1608]
R197  10k  R10K/1608(0603)  [R1608]
R198  220  R220/1608(0603)  [R1608]
R199  220  R220/1608(0603)  [R1608]
R200  220  R220/1608(0603)  [R1608]
R205  220  R220/1608(0603)  [R1608]
R206  10k  R10K/1608(0603)  [R1608]
R207  10k  R10K/1608(0603)  [R1608]
R208  220  R220/1608(0603)  [R1608]
R209  220  R220/1608(0603)  [R1608]
U1  AZ1117H-ADJTRE1SOT-223_DIO  [SOT-223_DIO]
U$3  RESETABLEFUSE  [R3216]
U$9  MCP4018T-503E/LT  [SOT65P210X110-6N]
U$27  SS2040FL  [SDO-123FL]
U$57  SS2040FL  [SDO-123FL]
UART1  JST-XH-4PIN  B4B-XH-A  [B4B-XH-A]

## Nets
1-1: IC12.1(OUTPUT_A) PIC32MK1024MCM100.48(AN39/CVD39/RD15) R6.1
1-2: IC12.7(OUTPUT_B) PIC32MK1024MCM100.49(TDI/DAC3/AN26/CVD26/RPA8/SDA2/PMA9/RA8) R12.2
2-1: IC13.1(OUTPUT_A) PIC32MK1024MCM100.47(AN38/CVD38/RD14) R14.1
2-2: IC13.7(OUTPUT_B) PIC32MK1024MCM100.61(AN45/CVD45/RF5) R15.2
3-1: IC14.1(OUTPUT_A) PIC32MK1024MCM100.66(AN46/CVD46/RPA14/RA14) R16.1
3-2: IC14.7(OUTPUT_B) PIC32MK1024MCM100.67(AN47/CVD47/RPA15/RA15) R17.2
4-1: IC15.1(OUTPUT_A) PIC32MK1024MCM100.68(RD8) R21.1
4-2: IC15.7(OUTPUT_B) PIC32MK1024MCM100.72(OA5OUT/AN25/CVD25/C5IN4-/RPB7/SCK1/INT0/RB7) R86.2
5-1: IC16.1(OUTPUT_A) PIC32MK1024MCM100.73(SOSCI/RPC13/RC13) R87.1
5-2: IC16.7(OUTPUT_B) PIC32MK1024MCM100.74(SOSCO/T1CK/RPB8/RB8) R146.2
6-1: IC17.1(OUTPUT_A) PIC32MK1024MCM100.76(TMS/OA5IN-/AN27/CVD27/LVDIN/C5IN1-/RPB9/RB9) R147.1
6-2: IC17.7(OUTPUT_B) PIC32MK1024MCM100.77(RPC6/USBID2/PMA16/RC6) R148.2
7-1: IC18.1(OUTPUT_A) PIC32MK1024MCM100.79(PMD12/RD12) R149.1
7-2: IC18.7(OUTPUT_B) PIC32MK1024MCM100.78(RPC7/PMA17/RC7) R150.2
8-1: IC19.1(OUTPUT_A) PIC32MK1024MCM100.80(PMD13/RD13) R151.1
8-2: IC19.7(OUTPUT_B) PIC32MK1024MCM100.81(RPC8/PMWR/RC8) R152.2
9-1: IC20.1(OUTPUT_A) PIC32MK1024MCM100.93(RPB10/PWM3H/PMD0/RB10) R7.1
9-2: IC20.7(OUTPUT_B) PIC32MK1024MCM100.94(RPB11/PWM9H/PWM3L/PMD1/RB11) R8.2
10-1: IC21.1(OUTPUT_A) PIC32MK1024MCM100.98(RPB12/PWM2H/PMD2/RB12) R9.1
10-2: IC21.7(OUTPUT_B) PIC32MK1024MCM100.99(RPB13/PWM8H/PWM2L/CTPLS/PMD3/RB13) R10.2
11-1: IC22.1(OUTPUT_A) PIC32MK1024MCM100.4(RPB14/PWM1H/VBUSON1/PMD6/RB14) R11.1
11-2: IC22.7(OUTPUT_B) PIC32MK1024MCM100.5(RPB15/PWM7H/PWM1L/PMD7/RB15) R13.2
12-1: IC23.1(OUTPUT_A) PIC32MK1024MCM100.6(PWM11H/PWM5L/RD1) R153.1
12-2: IC23.7(OUTPUT_B) PIC32MK1024MCM100.7(PWM5H/RD2) R154.2
13-1: IC24.1(OUTPUT_A) PIC32MK1024MCM100.11(AN18/CVD18/RPG7/PWM10H/SCL1/PMA4/RG7) R155.1
13-2: IC24.7(OUTPUT_B) PIC32MK1024MCM100.12(AN17/CVD17/RPG8/SDA1/PMA3/RG8) R156.2
14-1: IC25.1(OUTPUT_A) PIC32MK1024MCM100.26(PGC1/OA1IN+/AN4/C1IN1+/C1IN3-/C2IN3-/RPB2/RB2) R157.1
14-2: IC25.7(OUTPUT_B) R158.2
15-1: IC26.1(OUTPUT_A) PIC32MK1024MCM100.27(PGD1/OA1IN-/AN5/CTCMP/C1IN1-/RTCC/RPB3/RB3) R159.1
15-2: IC26.7(OUTPUT_B) PIC32MK1024MCM100.28(VREF-/AN33/CVD33/PMA7/RF9) R160.2
16-1: IC28.1(OUTPUT_A) PIC32MK1024MCM100.33(OA3IN-/AN7/CVD7/C3IN1-/C4IN1-/RPC1/RC1) R161.1
16-2: IC28.7(OUTPUT_B) PIC32MK1024MCM100.34(OA3IN+/AN8/CVD8/C3IN1+/C3IN3-/RPC2/FLT3/PMA13/RC2) R162.2
+3.3V: 1.1(C) 2.1(C) 3.1(C) 4.1(C) 5.1(C) 6.1(C) 7.1(C) 8.1(C) 9.1(C) 10.1(C) 11.1(C) 12.1(C) 13.1(C) 14.1(C) 15.1(C) 16.1(C) 17.1(C) 18.1(C) 19.1(C) 20.1(C) 21.1(C) 22.1(C) 23.1(C) 24.1(C) 25.1(C) 26.1(C) 27.1(C) 28.1(C) 29.1(C) 30.1(C) 31.1(C) 32.1(C) 33.1(C) 34.1(C) 35.1(C) 36.1(C) 37.1(C) 38.1(C) 39.1(C) 40.1(C) 41.1(C) 42.1(C) 43.1(C) 44.1(C) 45.1(C) 46.1(C) 47.1(C) 48.1(C) 49.1(C) 50.1(C) 51.1(C) 52.1(C) 53.1(C) 54.1(C) 55.1(C) 57.1(C) 59.1(C) 60.1(C) 61.1(C) 63.1(C) C1.1 C2.2 C4.1 C5.2 C6.1 C7.1 C8.1 C9.2 C10.1 C14.1 C15.1 C17.2 C18.1 C19.1 C20.1 C22.1 C23.1 C24.1 C25.1 C26.1 C27.1 C28.1 C29.1 C30.1 C31.1 C32.1 C33.1 C34.1 C35.1 C36.1 C37.1 C38.1 C39.+(P$1+) C40.1 C41.1 C42.1 C43.1 C44.1 C45.1 C46.1 C48.1 DEBUG_UART.1 IC1.2(OUTPUT) IC1.4(VOUT) IC2.8(VCC) IC3.8(VCC) IC5.8(VCC) IC6.8(VCC) IC8.8(VCC) IC9.8(VCC) IC11.8(VCC) IC12.8(VCC) IC13.8(VCC) IC14.8(VCC) IC15.8(VCC) IC16.8(VCC) IC17.8(VCC) IC18.8(VCC) IC19.8(VCC) IC20.8(VCC) IC21.8(VCC) IC22.8(VCC) IC23.8(VCC) IC24.8(VCC) IC25.8(VCC) IC26.8(VCC) IC27.8(VCC) IC28.8(VCC) IC29.8(VCC) IC30.8(VCC) IC31.8(VCC) IC32.8(VCC) IC33.8(VCC) IC34.8(VCC) MCLR.2 PIC32MK1024MCM100.2(VDD_1) PIC32MK1024MCM100.16(VDD_2) PIC32MK1024MCM100.30(AVDD) PIC32MK1024MCM100.37(VDD_3) PIC32MK1024MCM100.46(VDD_4) PIC32MK1024MCM100.55(VUSB3V3) PIC32MK1024MCM100.62(VDD_5) PIC32MK1024MCM100.86(VDD_6) Q2.1(G) R1.2 R2.2 R3.2 R4.2 R6.2 R7.2 R8.1 R9.2 R10.1 R11.2 R12.1 R13.1 R14.2 R15.1 R16.2 R17.1 R21.2 R86.1 R87.2 R146.1 R147.2 R148.1 R149.2 R150.1 R151.2 R152.1 R153.2 R154.1 R155.2 R156.1 R157.2 R158.1 R159.2 R160.1 R161.2 R162.1 R163.2 R164.2 R165.1 R168.2 R169.1 R170.2 R171.1 R174.2 R175.1 R176.2 R177.1 R180.1 R181.2 R182.2 R183.1 R184.2 R186.2 R187.1 R189.1 R190.2 R191.1 R192.2 R194.1 R195.2 R197.1 R206.2 U$9.1(VDD) UART1.1 ; supply symbol labelled VCC-3.3V
+5V: J2.1 U$3.1 ; supply symbol labelled VCC-5V
ANALOG-1: 63.2(E) PIC32MK1024MCM100.14(AN16/CVD16/RPG9/PMA2/RG9) R196.2
B1: IC9.1(OUTPUT_A) PIC32MK1024MCM100.21(AN9/CVD9/RPA11/RA11) R176.1
B1-IN: 13.2(E) 14.2(E) IC9.2(INPUTS_A-) R132.2 R133.2
B2: IC9.7(OUTPUT_B) PIC32MK1024MCM100.20(AN10/CVD10/RPA12/RA12) R177.2
B2-IN: 17.2(E) 18.2(E) IC9.6(INPUTS_B-) R136.2 R137.2
B3: IC34.1(OUTPUT_A) PIC32MK1024MCM100.19(AN20/CVD20/RE9) R195.1
B3-IN: 15.2(E) IC34.2(INPUTS_A-) R134.2
B4: IC34.7(OUTPUT_B) PIC32MK1024MCM100.18(AN21/CVD21/RE8) R197.2
B4-IN: 16.2(E) IC34.6(INPUTS_B-) R135.2
BB1: IC31.1(OUTPUT_A) PIC32MK1024MCM100.9(RPD4/PWM6H/RD4) R186.1
BB2: IC31.7(OUTPUT_B) PIC32MK1024MCM100.8(RPD3/PWM12H/PWM6L/RD3) R187.2
BB3: IC29.7(OUTPUT_B) PIC32MK1024MCM100.22(OA2OUT/AN0/C2IN4-/C4IN3-/RPA0/RA0) R189.2
BR1-IN: 53.2(E) IC31.2(INPUTS_A-) R140.2
BR2-IN: 54.2(E) IC31.6(INPUTS_B-) R141.2
BR3-IN: 55.2(E) IC29.6(INPUTS_B-) R142.2
DAC: IC2.3(INPUTS_A+) IC2.5(INPUTS_B+) IC3.3(INPUTS_A+) IC3.5(INPUTS_B+) IC5.3(INPUTS_A+) IC5.5(INPUTS_B+) IC6.3(INPUTS_A+) IC6.5(INPUTS_B+) IC8.3(INPUTS_A+) IC8.5(INPUTS_B+) IC9.3(INPUTS_A+) IC9.5(INPUTS_B+) IC11.3(INPUTS_A+) IC11.5(INPUTS_B+) IC12.3(INPUTS_A+) IC12.5(INPUTS_B+) IC13.3(INPUTS_A+) IC13.5(INPUTS_B+) IC14.3(INPUTS_A+) IC14.5(INPUTS_B+) IC15.3(INPUTS_A+) IC15.5(INPUTS_B+) IC16.3(INPUTS_A+) IC16.5(INPUTS_B+) IC17.3(INPUTS_A+) IC17.5(INPUTS_B+) IC18.3(INPUTS_A+) IC18.5(INPUTS_B+) IC19.3(INPUTS_A+) IC19.5(INPUTS_B+) IC20.3(INPUTS_A+) IC20.5(INPUTS_B+) IC21.3(INPUTS_A+) IC21.5(INPUTS_B+) IC22.3(INPUTS_A+) IC22.5(INPUTS_B+) IC23.3(INPUTS_A+) IC23.5(INPUTS_B+) IC24.3(INPUTS_A+) IC24.5(INPUTS_B+) IC25.3(INPUTS_A+) IC25.5(INPUTS_B+) IC26.3(INPUTS_A+) IC26.5(INPUTS_B+) IC27.3(INPUTS_A+) IC27.5(INPUTS_B+) IC28.3(INPUTS_A+) IC28.5(INPUTS_B+) IC29.3(INPUTS_A+) IC29.5(INPUTS_B+) IC30.3(INPUTS_A+) IC30.5(INPUTS_B+) IC31.3(INPUTS_A+) IC31.5(INPUTS_B+) IC32.3(INPUTS_A+) IC32.5(INPUTS_B+) IC33.3(INPUTS_A+) IC33.5(INPUTS_B+) IC34.3(INPUTS_A+) IC34.5(INPUTS_B+) PIC32MK1024MCM100.71(DAC2/AN48/CVD48/RPC10/PMA14/PMCS/RC10) R22.2
DI: PIC32MK1024MCM100.100(TDO/PWM4H/PMD4/RA10) Q2.2(S) R206.1
DI-OUT: LED1.4(DIN) Q2.3(D) R207.1
GND: +3.3V.C C1.2 C2.1 C3.2 C4.2 C5.1 C6.2 C7.2 C8.2 C9.1 C10.2 C11.2 C12.2 C14.2 C15.2 C17.1 C18.2 C19.2 C20.2 C22.2 C23.2 C24.2 C25.2 C26.2 C27.2 C28.2 C29.2 C30.2 C31.2 C32.2 C33.2 C34.2 C35.2 C36.2 C37.2 C38.2 C39.-(P$2-) C40.2 C41.2 C42.2 C43.2 C44.2 C45.2 C46.2 C47.2 C48.2 D1.C D2.C D3.C D4.C D5.C D6.C D7.C D8.C D9.C D10.C D11.C D12.C D13.C D14.C D15.C D16.C D17.C D18.C D19.C D20.C D21.C D22.C D23.C D24.C D25.C D26.C D27.C D28.C D29.C D30.C D31.C D32.C D33.C D34.C D35.C D36.C D37.C D38.C D39.C D40.C D41.C D42.C D43.C D44.C D45.C D46.C D47.C D48.C D49.C D50.C D51.C D52.C D53.C D54.C D55.C D56.C D57.C D58.C D59.C D60.C D61.C D62.C D63.C D64.C D65.C D66.C D67.C D68.C D69.C D70.C D71.C D72.C DEBUG_UART.4 IC1.1(ADJ/GND) IC2.4(GND) IC3.4(GND) IC5.4(GND) IC6.4(GND) IC8.4(GND) IC9.4(GND) IC11.4(GND) IC12.4(GND) IC13.4(GND) IC14.4(GND) IC15.4(GND) IC16.4(GND) IC17.4(GND) IC18.4(GND) IC19.4(GND) IC20.4(GND) IC21.4(GND) IC22.4(GND) IC23.4(GND) IC24.4(GND) IC25.4(GND) IC26.4(GND) IC27.4(GND) IC28.4(GND) IC29.4(GND) IC30.4(GND) IC31.4(GND) IC32.4(GND) IC33.4(GND) IC34.4(GND) J2.2 LED1.3(VSS) MCLR.3 PIC32MK1024MCM100.15(VSS_1) PIC32MK1024MCM100.31(AVSS) PIC32MK1024MCM100.36(VSS_2) PIC32MK1024MCM100.45(VSS_3) PIC32MK1024MCM100.54(VBUS) PIC32MK1024MCM100.58(VBUS2) PIC32MK1024MCM100.65(VSS_4) PIC32MK1024MCM100.75(VSS_5) PIC32MK1024MCM100.85(VSS_6) R22.1 R82.1 R83.1 R84.1 R88.1 R89.1 R90.1 R91.1 R92.1 R93.1 R94.1 R95.1 R96.1 R97.1 R98.1 R99.1 R100.1 R101.1 R102.1 R103.1 R104.1 R105.1 R106.1 R107.1 R108.1 R109.1 R110.1 R111.1 R112.1 R113.1 R114.1 R115.1 R116.1 R117.1 R118.1 R119.1 R120.1 R121.1 R122.1 R123.1 R124.1 R125.1 R126.1 R127.1 R128.1 R129.1 R130.1 R131.1 R132.1 R133.1 R134.1 R135.1 R136.1 R137.1 R138.1 R139.1 R140.1 R141.1 R142.1 R143.2 R144.1 R166.2 R167.2 R178.2 R196.1 U$9.2(VSS) U$27.P$1(A) UART1.4 ; supply symbol labelled GND-1
L1: IC6.1(OUTPUT_A) PIC32MK1024MCM100.3(TCK/RPA7/PWM10H/PWM4L/PMD5/RA7) R170.1
L1-IN: 7.2(E) IC6.2(INPUTS_A-) R126.2
L2: IC6.7(OUTPUT_B) PIC32MK1024MCM100.1(AN23/CVD23/PWM7L/PMA23/RG15) R171.2
L2-IN: 8.2(E) IC6.6(INPUTS_B-) R127.2
L3: IC11.1(OUTPUT_A) PIC32MK1024MCM100.97(TRD0/PWM7H/PMA22/RG13) R163.1
L3-IN: 9.2(E) IC11.2(INPUTS_A-) R128.2
L4: IC11.7(OUTPUT_B) PIC32MK1024MCM100.90(RPG0/PMD8/RG0) R180.2
L4-IN: 10.2(E) IC11.6(INPUTS_B-) R129.2
L5: IC8.1(OUTPUT_A) PIC32MK1024MCM100.89(RPG1/PMD9/RG1) R174.1
L5-IN: 11.2(E) IC8.2(INPUTS_A-) R130.2
L6: IC8.7(OUTPUT_B) PIC32MK1024MCM100.84(RPC9/PMD15/RC9) R175.2
L6-IN: 12.2(E) IC8.6(INPUTS_B-) R131.2
L7: PIC32MK1024MCM100.83(RPD6/PWM12L/PMD14/RD6)
L8: PIC32MK1024MCM100.82(RPD5/PWM12H/PMRD/RD5)
LED_OUT: C12.1 R5.2 R18.2 R19.2 R20.2 R23.2 R24.2 R25.2 R26.2 R27.2 R28.2 R29.2 R30.2 R31.2 R32.2 R33.2 R34.2 R35.2 R36.2 R37.2 R38.2 R39.2 R40.2 R41.2 R42.2 R43.2 R44.2 R45.2 R46.2 R47.2 R48.2 R49.2 R50.2 R51.2 R52.2 R53.2 R54.2 R55.2 R56.2 R57.2 R58.2 R59.2 R60.2 R61.2 R62.2 R63.2 R64.2 R65.2 R66.2 R67.2 R68.2 R69.2 R70.2 R71.2 R72.2 R73.2 R74.2 R75.2 R76.2 R77.2 R78.2 R79.2 R80.2 R81.2 R85.2 R145.2 R172.2 R173.2 R198.2 R199.2 R200.2 R205.2 R208.2 R209.2 U1.2(OUTPUT) U1.4(EPAD) U$27.P$2(C)
LL1: IC32.1(OUTPUT_A) PIC32MK1024MCM100.95(TRD2/PWM8H/PMA20/RG14) R190.1
LL2: IC32.7(OUTPUT_B) PIC32MK1024MCM100.92(TRD3/PWM9L/PMA19/RF7) R191.2
LL3: IC3.1(OUTPUT_A) PIC32MK1024MCM100.96(TRD1/RPG12/PWM8L/PMA21/RG12) R192.1
LR1-IN: 59.2(E) IC32.2(INPUTS_A-) R82.2
LR2-IN: 60.2(E) IC32.6(INPUTS_B-) R83.2
LR3-IN: 61.2(E) IC3.2(INPUTS_A-) R84.2
LR4-IN: IC3.6(INPUTS_B-)
MCLR: MCLR.1 PIC32MK1024MCM100.13(!MCLR) R3.1
N$1: +3.3V.A R1.1
N$2: D2.A R55.1
N$3: D3.A R56.1
N$4: D4.A R57.1
N$5: D5.A R58.1
N$6: D20.A R23.1
N$7: D21.A R24.1
N$8: D22.A R25.1
N$9: D24.A R27.1
N$10: D25.A R28.1
N$11: D26.A R29.1
N$12: D27.A R30.1
N$13: D28.A R31.1
N$14: D29.A R32.1
N$15: D30.A R33.1
N$16: D31.A R34.1
N$17: D32.A R35.1
N$18: D33.A R36.1
N$19: D35.A R38.1
N$20: D34.A R37.1
N$21: D23.A R26.1
N$22: D36.A R39.1
N$23: D37.A R40.1
N$24: D38.A R41.1
N$25: D6.A R59.1
N$26: D39.A R42.1
N$27: D40.A R43.1
N$28: D41.A R44.1
N$29: D42.A R45.1
N$30: D43.A R46.1
N$31: D44.A R47.1
N$32: D45.A R48.1
N$33: D46.A R49.1
N$34: D47.A R50.1
N$35: D48.A R51.1
N$36: D49.A R52.1
N$37: D50.A R53.1
N$38: D51.A R54.1
N$39: D7.A R60.1
N$40: D8.A R61.1
N$41: D9.A R62.1
N$42: D10.A R63.1
N$43: D11.A R64.1
N$44: D12.A R65.1
N$45: D13.A R66.1
N$46: D14.A R67.1
N$47: D15.A R68.1
N$48: D16.A R69.1
N$49: D17.A R70.1
N$50: D18.A R71.1
N$51: D19.A R72.1
N$52: D52.A R73.1
N$53: D53.A R74.1
N$54: D54.A R75.1
N$55: D1.A R76.1
N$56: D56.A R78.1
N$57: R5.1 U1.1(ADJ/GND) U$9.5(W)
N$58: D57.A R79.1
N$59: D58.A R80.1
N$60: D59.A R81.1
N$61: D64.A R205.1
N$62: D55.A R77.1
N$63: D61.A R199.1
N$64: D62.A R20.1
N$65: D65.A R208.1
N$66: U$3.2 U$57.P$1(A)
N$67: D60.A R198.1
N$68: D66.A R209.1
N$69: D63.A R200.1
N$70: D67.A R145.1
N$71: D68.A R172.1
N$72: D69.A R173.1
N$73: D70.A R18.1
N$74: D71.A R19.1
N$75: D72.A R85.1
N$76: PIC32MK1024MCM100.91(TRCLK/PWM9H/PMA18/RF6)
N$77: PIC32MK1024MCM100.41(AN12/CVD12/C2IN2-/C5IN2-/SDA4/FLT5/PMA11/RE12)
N$78: PIC32MK1024MCM100.56(D1-) R178.1
N$79: PIC32MK1024MCM100.57(D1+) R167.1
N$80: PIC32MK1024MCM100.59(D2-) R143.1
N$81: PIC32MK1024MCM100.60(D2+) R166.1
OUT_5V: C3.1 C11.1 C47.1 IC1.3(INPUT) LED1.1(VDD) R207.2 U1.3(INPUT) U$57.P$2(C)
PGC: MCLR.5 PIC32MK1024MCM100.25(PGC3/OA1OUT/AN3/C1IN4-/C4IN2-/RPB1/CTED1/RB1)
PGD: MCLR.4 PIC32MK1024MCM100.24(PGD3/OA2IN-/AN2/C2IN1-/RPB0/CTED2/RB0)
R1: IC27.1(OUTPUT_A) PIC32MK1024MCM100.35(AN11/CVD11/C1IN2-/FLT4/PMA12/RC11) R164.1
R1-IN: 1.2(E) IC27.2(INPUTS_A-) R120.2
R2: IC27.7(OUTPUT_B) PIC32MK1024MCM100.38(AN35/CVD35/RG11) R165.2
R2-IN: 2.2(E) IC27.6(INPUTS_B-) R121.2
R3: IC33.1(OUTPUT_A) PIC32MK1024MCM100.29(VREF+/AN34/CVD34/PMA6/RF10) R181.1
R3-IN: 3.2(E) IC33.2(INPUTS_A-) R122.2
R4: IC33.7(OUTPUT_B) PIC32MK1024MCM100.32(OA3OUT/AN6/CVD6/C3IN4-/C4IN1+/C4IN4-/RPC0/RC0) R194.2
R4-IN: 4.2(E) IC33.6(INPUTS_B-) R123.2
R5: IC5.1(OUTPUT_A) PIC32MK1024MCM100.52(AN40/CVD40/RPE0/RE0) R168.1
R5-IN: 5.2(E) IC5.2(INPUTS_A-) R124.2
R6: IC5.7(OUTPUT_B) PIC32MK1024MCM100.53(AN41/CVD41/RPE1/RE1) R169.2
R6-IN: 6.2(E) IC5.6(INPUTS_B-) R125.2
RR1: IC2.1(OUTPUT_A) PIC32MK1024MCM100.50(FLT15/RPB4/SCL2/PMA8/RB4) R182.1
RR1-IN: 51.2(E) IC2.2(INPUTS_A-) R138.2
RR2: IC2.7(OUTPUT_B) PIC32MK1024MCM100.40(AN37/CVD37/RF12) R183.2
RR2-IN: 52.2(E) IC2.6(INPUTS_B-) R139.2
RR3: IC30.1(OUTPUT_A) PIC32MK1024MCM100.51(OA5IN+/DAC1/AN24/CVD24/C5IN1+/C5IN3-/RPA4/RA4) R184.1
RR3-IN: 57.2(E) IC30.2(INPUTS_A-) R144.2
RR4: PIC32MK1024MCM100.39(AN36/CVD36/RF13)
S1-IN: 19.2(E) IC12.2(INPUTS_A-) R88.2
S2-IN: 20.2(E) IC12.6(INPUTS_B-) R89.2
S3-IN: 21.2(E) IC13.2(INPUTS_A-) R90.2
S4-IN: 22.2(E) IC13.6(INPUTS_B-) R91.2
S5-IN: 23.2(E) IC14.2(INPUTS_A-) R92.2
S6-IN: 24.2(E) IC14.6(INPUTS_B-) R93.2
S7-IN: 25.2(E) IC15.2(INPUTS_A-) R94.2
S8-IN: 26.2(E) IC15.6(INPUTS_B-) R95.2
S9-IN: 27.2(E) IC16.2(INPUTS_A-) R96.2
S10-IN: 28.2(E) IC16.6(INPUTS_B-) R97.2
S11-IN: 29.2(E) IC17.2(INPUTS_A-) R98.2
S12-IN: 30.2(E) IC17.6(INPUTS_B-) R99.2
S13-IN: 31.2(E) IC18.2(INPUTS_A-) R100.2
S14-IN: 32.2(E) IC18.6(INPUTS_B-) R101.2
S15-IN: 33.2(E) IC19.2(INPUTS_A-) R102.2
S16-IN: 34.2(E) IC19.6(INPUTS_B-) R103.2
S17-IN: 35.2(E) IC20.2(INPUTS_A-) R104.2
S18-IN: 36.2(E) IC20.6(INPUTS_B-) R105.2
S19-IN: 37.2(E) IC21.2(INPUTS_A-) R106.2
S20-IN: 38.2(E) IC21.6(INPUTS_B-) R107.2
S21-IN: 39.2(E) IC22.2(INPUTS_A-) R108.2
S22-IN: 40.2(E) IC22.6(INPUTS_B-) R109.2
S23-IN: 41.2(E) IC23.2(INPUTS_A-) R110.2
S24-IN: 42.2(E) IC23.6(INPUTS_B-) R111.2
S25-IN: 43.2(E) IC24.2(INPUTS_A-) R112.2
S26-IN: 44.2(E) IC24.6(INPUTS_B-) R113.2
S27-IN: 45.2(E) IC25.2(INPUTS_A-) R114.2
S28-IN: 46.2(E) IC25.6(INPUTS_B-) R115.2
S29-IN: 47.2(E) IC26.2(INPUTS_A-) R116.2
S30-IN: 48.2(E) IC26.6(INPUTS_B-) R117.2
S31-IN: 49.2(E) IC28.2(INPUTS_A-) R118.2
S32-IN: 50.2(E) IC28.6(INPUTS_B-) R119.2
SCL3: PIC32MK1024MCM100.70(PGC2/RPB6/SCL3/SCK2/PMA15/RB6) R4.1 U$9.3(SCL)
SDA3: PIC32MK1024MCM100.69(PGD2/RPB5/SDA3/USBID1/RB5) R2.1 U$9.4(SDA)
U1-RX: PIC32MK1024MCM100.87(RPF0/PWM11H/PMD11/RF0) UART1.3
U1-TX: PIC32MK1024MCM100.88(RPF1/PWM11L/PMD10/RF1) UART1.2
U5-RX: DEBUG_UART.3 PIC32MK1024MCM100.64(OSCO/CLKO/RPC15/RC15)
U5-TX: DEBUG_UART.2 PIC32MK1024MCM100.63(OSCI/CLKI/AN49/CVD49/RPC12/RC12)
Unconnected: IC3.7(OUTPUT_B) IC29.1(OUTPUT_A) IC29.2(INPUTS_A-) IC30.6(INPUTS_B-) IC30.7(OUTPUT_B) LED1.2(DOUT) PIC32MK1024MCM100.10(AN19/CVD19/RPG6/PWM10L/VBUSON2/PMA5/RG6) PIC32MK1024MCM100.17(AN22/CVD22/RG10) PIC32MK1024MCM100.23(OA2IN+/AN1/C2IN1+/RPA1/RA1) PIC32MK1024MCM100.42(AN13/CVD13/C3IN2-/SCL4/FLT6/PMA10/RE13) PIC32MK1024MCM100.43(AN14/CVD14/RPE14/FLT7/PMA1/RE14) PIC32MK1024MCM100.44(AN15/CVD15/RPE15/FLT8/PMA0/RE15) U$9.6(A)

## Notes on the sheet
- R5の値を変更

## Library data of the parts
1-55 57 59-61 63 = Robo_muscle-senser:ALS-PT19-315C/L177/TR8; LCSC: C146233
+3.3V = Diode:LED; LCSC: C2286
C1 C2 C5-C10 C14 C15 C17-C20 C22-C38 C40-C48 = Robocon-RLC:CC: Ceramic Condensare
C3 C11 = RLC:CC: Ceramic Condensare; LCSC: C96446
C4 C12 = RLC:CC: Ceramic Condensare; LCSC: C59461
C39 = Robocon-RLC:C+: Condensare
D1-D72 = Robo_muscle-Diode:LED; LCSC: C2286
DEBUG_UART = jst_XH:S4B-XH-A: Wire-to-Board 2.5mm pitch side mount connector Source: http://www.jst-mfg.com/product/pdf/jpn/XH.pdf http://www.jst-mfg.com/product/detail.php?series=277
IC1 = AZ1117CH-3.3TRG1:AZ1117CH-3.3TRG1: 1.35A 3.3V LDO Reg. Current Limit SOT223 DiodesZetex AZ1117CH-3.3TRG1, LDO Voltage Regulator, 0.8A, 3.3 V +/-1%, maximum of 15 Vin, 3-Pin SOT-223 Source: Datasheet <https://www.diodes.com//assets/Datasheets/AZ1117C.pdf>; ARROW_PART_NUMBER: AZ1117CH-3.3TRG1; ARROW_PRICE-STOCK: https://www.arrow.com/en/products/az1117ch-3.3trg1/diodes-incorporated?utm_currency=USD&region=nac; DESCRIPTION: 1.35A 3.3V LDO Reg. Current Limit SOT223 DiodesZetex AZ1117CH-3.3TRG1, LDO Voltage Regulator, 0.8A, 3.3 V +/-1%, maximum of 15 Vin, 3-Pin SOT-223; HEIGHT: 1.8mm; LCSC: C92102; MANUFACTURER_NAME: Diodes Incorporated; MANUFACTURER_PART_NUMBER: AZ1117CH-3.3TRG1; MOUSER_PART_NUMBER: 621-AZ1117CH-3.3TRG1; MOUSER_PRICE-STOCK: https://www.mouser.co.uk/ProductDetail/Diodes-Incorporated/AZ1117CH-3.3TRG1?qs=FKu9oBikfSm7ntaG6olPSQ%3D%3D
IC2 IC3 IC5 IC6 IC8 IC9 IC11-IC34 = Robo_muscle-IC:LM393DR2G: ON Semiconductor LM2903DR2G Dual Comparator, Open Collector O/P, 1.5us 3 28 V 8-pin SOIC Source: Datasheet <https://www.onsemi.com/pub/Collateral/LM393-D.PDF>; LCSC: C7955
J2 = Connector:B2B-XH-A: XH Connector Top Entry - 2POS Details see: Datasheet <http://www.jst-mfg.com/product/pdf/eng/eXH.pdf>; CATEGORY: Header; DESCRIPTION: Connector Header Through Hole 2 position 0.098" (2.50mm); MANUFACTURER: JST Sales America Inc.; MPN: B2B-XH-A(LF)(SN); OPERATING_TEMPERATURE: -25°C ~ 85°C; PART_STATUS: ACTIVE; PITCH: 0.098" (2.50mm); ROHS_COMPLIANCE: ROHS3 Compliant; SERIES: XH; SUB_CATEGORY: Rectangular Connectors; TYPE: Header, Male Pin, Board to Cable/Wire, Through Hole
LED1 = WS2812B-B:WS2812B-B: Light Emitting Diodes (LED) RGB 620~630nm Red, 515~530nm Green, 465~475nm Blue 550~700mcd@16mA Red, 1100~1400mcd@16mA Green, 200~400mcd@16mA Blue Top View 5050 RoHS Source: Datasheet <http://www.world-semi.com/DownLoadFile/111>; DESCRIPTION: Light Emitting Diodes (LED) RGB 620~630nm Red, 515~530nm Green, 465~475nm Blue 550~700mcd@16mA Red, 1100~1400mcd@16mA Green, 200~400mcd@16mA Blue Top View 5050 RoHS; HEIGHT: 1.62mm; MANUFACTURER_NAME: Worldsemi; MANUFACTURER_PART_NUMBER: WS2812B-B
MCLR = Robocon-Connector:PINHD1X05L
PIC32MK1024MCM100 = PIC32MK1024MCM100T-E_PT:PIC32MK1024MCM100T-E_PT: 32-bit Microcontrollers - MCU PIC32MK, 1MB Flash, Motor Control Version, 2x USB, CAN-FD, 100 pin TQFP Source: Datasheet <https://ww1.microchip.com/downloads/en/DeviceDoc/PIC32MK-GPK-MCM-with-CAN-FD-Family-DataSheet-DS60001519E.pdf>; DESCRIPTION: 32-bit Microcontrollers - MCU PIC32MK, 1MB Flash, Motor Control Version, 2x USB, CAN-FD, 100 pin TQFP; HEIGHT: 1.2mm; MANUFACTURER_NAME: Microchip; MANUFACTURER_PART_NUMBER: PIC32MK1024MCM100T-E/PT; MOUSER_PART_NUMBER: 579-1024MCM100T-E/PT; MOUSER_PRICE-STOCK: https://www.mouser.co.uk/ProductDetail/Microchip-Technology/PIC32MK1024MCM100T-E-PT?qs=W%2FMpXkg%252BdQ5OvM2b1kce4w%3D%3D
Q2 = BSS138:BSS138: Compact industry standard SOT-23 surface mount package.; 0.22 A, 50 V. RDS(ON) = 3.5 @ VGS = 10 V. RDS(ON) = 6.0 @ VGS = 4.5 V; Rugged and Reliable.; High density cell design for extremely low RDS(ON). Source: Datasheet <https://www.onsemi.com/pub/Collateral/BSS138-D.PDF>; ARROW_PART_NUMBER: BSS138; ARROW_PRICE-STOCK: https://www.arrow.com/en/products/bss138/on-semiconductor?utm_currency=USD&region=europe; DESCRIPTION: Compact industry standard SOT-23 surface mount package.; 0.22 A, 50 V. RDS(ON) = 3.5 @ VGS = 10 V. RDS(ON) = 6.0 @ VGS = 4.5 V; Rugged and Reliable.; High density cell design for extremely low RDS(ON).; HEIGHT: 1.2mm; LCSC: C8490; MANUFACTURER_NAME: onsemi; MANUFACTURER_PART_NUMBER: BSS138; MOUSER_PART_NUMBER: 512-BSS138; MOUSER_PRICE-STOCK: https://www.mouser.co.uk/ProductDetail/onsemi-Fairchild/BSS138?qs=HK%252BeIG1iaahCeqBvjB4arg%3D%3D
R1 = RLC:R: Resistor; LCSC: C21190
R2-R4 R6-R17 R21 R22 R86 R87 R143 R146-R171 R174-R178 R180-R184 R186 R187 R189-R192 R194 R195 R197 R206 R207 = RLC:R: Resistor; LCSC: C25804
R5 = RLC:R: Resistor; LCSC: C21190; VALUE: 1k
R18-R20 R23-R81 R85 R145 R172 R173 R198-R200 R205 R208 R209 = RLC:R: Resistor; LCSC: C1226
R82-R84 R88-R142 R144 R196 = RLC:R: Resistor; LCSC: C190427
U1 = AZ1117H-ADJ:AZ1117H-ADJTRE1; COPYRIGHT: Copyright (C) 2025 Ultra Librarian. All rights reserved.; LCSC: C92103; MANUFACTURER_NAME: Diodes Inc; MANUFACTURER_PART_NUMBER: AZ1117H-ADJTRE1
U$3 = FUSE:RESETABLEFUSE
U$9 = MCP4018T-503E_LT:MCP4018T-503E/LT; LCSC: C145561; MPN: MCP4018T-503E/LT; OC_FARNELL: 1825019; OC_NEWARK: 08R1803; PACKAGE: SOT-6; SUPPLIER: Microchip
U$27 U$57 = Robocon-Diode:SS2040FL; LCSC: C268712
UART1 = Connector:B4B-XH-A: XH Connector Top Entry - 4POS Details see: Datasheet <http://www.jst-mfg.com/product/pdf/eng/eXH.pdf>; CATEGORY: Header; DSECRIPTION: Connector Header Through Hole 4 position 0.098" (2.50mm); MANUFACTURER: JST Sales America Inc.; MPN: B4B-XH-A(LF)(SN); OPERATING_TEMPERATURE: -25 C to 85 C; PART_STATUS: ACTIVE; PITCH: 0.098" (2.50mm); ROHS_COMPLIANCE: ROHS3 Compliant; SERIES: XH; SUB_CATEGORY: Rectangular Connectors; TYPE: Header, Male Pin, Board to Cable/Wire, Through Hole